# EAGLE design transponder-10.9.0 (EAGLE 9.6.2)
Assembly variants: Production

## Sheet 1 of 7
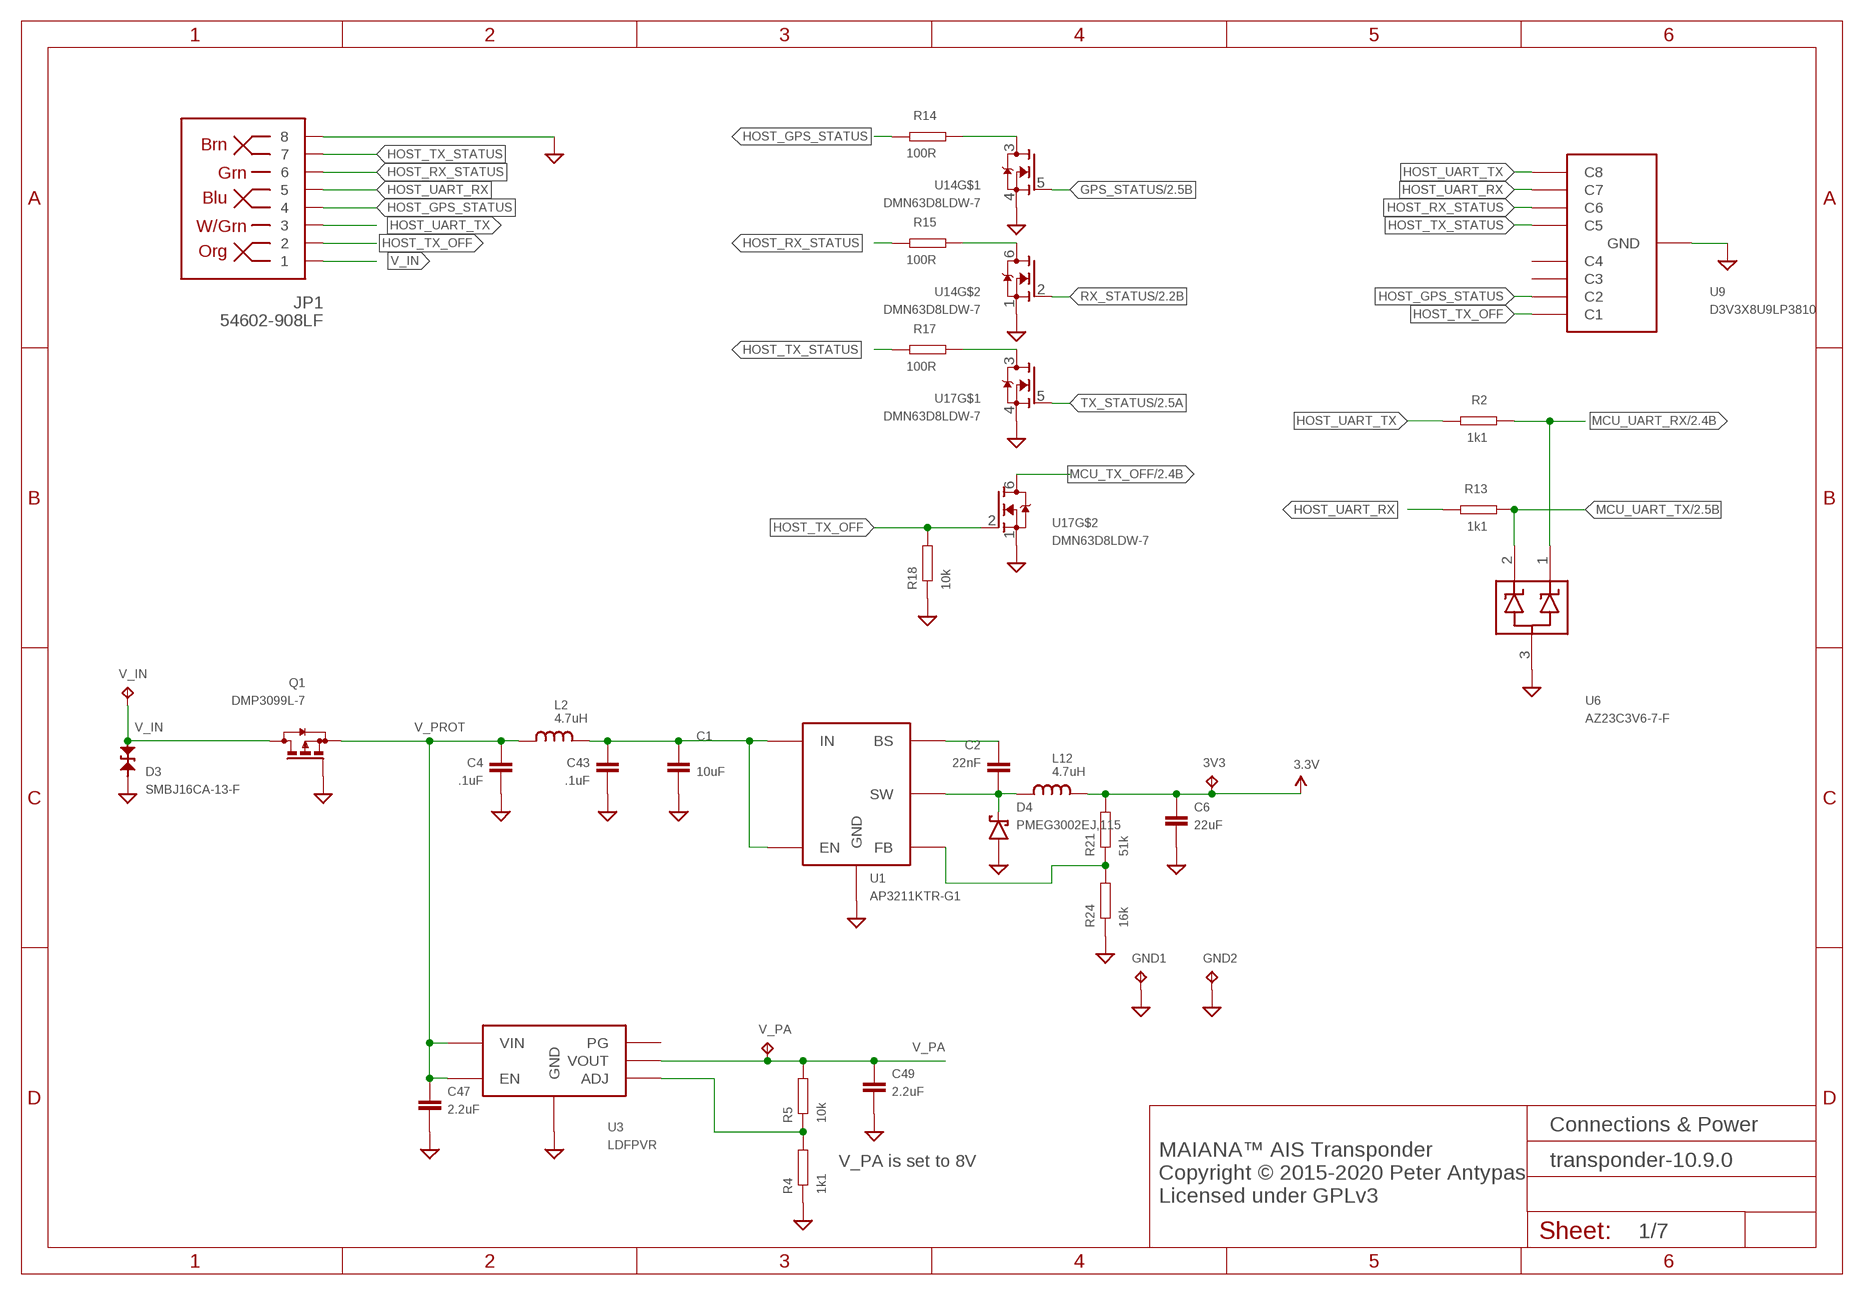
[diagram p0: schematic, sheet 1]

### Parts
3V3  TPTP12R  [TP12R]
C1  10uF  CAPACITOR0805  [0805]
C2  22nF  CAPACITOR0603  [0603]
C4  .1uF  CAPACITOR0603  [0603]
C6  22uF  CAPACITOR0805  [0805]
C43  .1uF  CAPACITOR0603  [0603]
C47  2.2uF  CAPACITOR0603  [0603]
C49  2.2uF  CAPACITOR0603  [0603]
D3  SMBJ16CA-13-F  DIODE-TVS-BIDIRSMB  [SMB-BIDIR]
D4  PMEG3002EJ,115  DIODE-SCHOTTKYSOD323  [SOD323]
GND1  TPTP12R  [TP12R]
GND2  TPTP12R  [TP12R]
JP1  54602-908LF  RJ45-8PTH  [RJ45-8]
L2  4.7uH  INDUCTOR0805  [0805]
L12  4.7uH  INDUCTOR0805  [0805]
Q1  DMP3099L-7  BSS84  [SOT23]
R2  1k1  RESISTOR0603  [0603]
R4  1k1  RESISTOR0603  [0603]
R5  10k  RESISTOR0603  [0603]
R13  1k1  RESISTOR0603  [0603]
R14  100R  RESISTOR0603  [0603]
R15  100R  RESISTOR0603  [0603]
R17  100R  RESISTOR0603  [0603]
R18  10k  RESISTOR0603  [0603]
R21  51k  RESISTOR0603  [0603]
R24  16k  RESISTOR0603  [0603]
U1  AP3211KTR-G1  AP3211  [SOT23-6]
U3  LDFPVR  [DFN6-2X2]
U6  AZ23C3V6-7-F  [SOT-23]
U9  D3V3X8U9LP3810  [U-DFN3810-9(B)]
U14  DMN63D8LDW-7  DMN63D8LDW  [SOT363]
U17  DMN63D8LDW-7  DMN63D8LDW  [SOT363]
V_IN  TPTP12R  [TP12R]
V_PA  TPTP12R  [TP12R]

### Nets
3.3V: 3V3.TP C6.P$1 L12.P$2 R21.P$2 ; also sheet 2,4,6,7
GND: C1.P$2 C4.P$2 C6.P$2 C43.P$2 C47.P$2 C49.P$2 D3.C D4.A GND1.TP GND2.TP JP1.8 Q1.1(G) R4.P$1 R18.P$1 R24.P$1 U1.2(GND) U3.P$4(GND) U3.P$7(GND) U6.3 U9.P$3(GND) U14.1(S) U14.4(S) U17.1(S) U17.4(S) ; also sheet 2,3,4,5,6,7
GPS_STATUS: U14.5(G) ; also sheet 2
HOST_GPS_STATUS: JP1.4 R14.P$2 U9.P$2(C2)
HOST_RX_STATUS: JP1.6 R15.P$2 U9.P$7(C6)
HOST_TX_OFF: JP1.2 R18.P$2 U9.P$1(C1) U17.2(G)
HOST_TX_STATUS: JP1.7 R17.P$2 U9.P$6(C5)
HOST_UART_RX: JP1.5 R13.P$2 U9.P$8(C7)
HOST_UART_TX: JP1.3 R2.P$2 U9.P$9(C8)
MCU_TX_OFF: U17.6(D) ; also sheet 2
MCU_UART_RX: R2.P$1 U6.1 ; also sheet 2
MCU_UART_TX: R13.P$1 U6.2 ; also sheet 2
N$8: C2.P$2 D4.C L12.P$1 U1.6(SW)
N$13: R14.P$1 U14.3(D)
N$14: R15.P$1 U14.6(D)
N$20: R17.P$1 U17.3(D)
N$21: C2.P$1 U1.1(BS)
N$22: R21.P$1 R24.P$2 U1.3(FB)
N$27: C1.P$1 C43.P$1 L2.P$2 U1.4(EN) U1.5(IN)
N$32: R4.P$2 R5.P$1 U3.P$2(ADJ)
RX_STATUS: U14.2(G) ; also sheet 2
TX_STATUS: U17.5(G) ; also sheet 2
V_IN: D3.A JP1.1 Q1.3(D) V_IN.TP
V_PA: C49.P$1 R5.P$2 U3.P$1(VOUT) V_PA.TP ; also sheet 5
V_PROT: C4.P$1 C47.P$1 L2.P$1 Q1.2(S) U3.P$5(EN) U3.P$6(VIN)
Unconnected: U3.P$3(PG) U9.P$4(C3) U9.P$5(C4)

### Notes on the sheet
- Connections & Power
- V_PA is set to 8V
- MAIANA™ AIS Transponder
  Copyright © 2015-2020 Peter Antypas
  Licensed under GPLv3

## Sheet 2 of 7
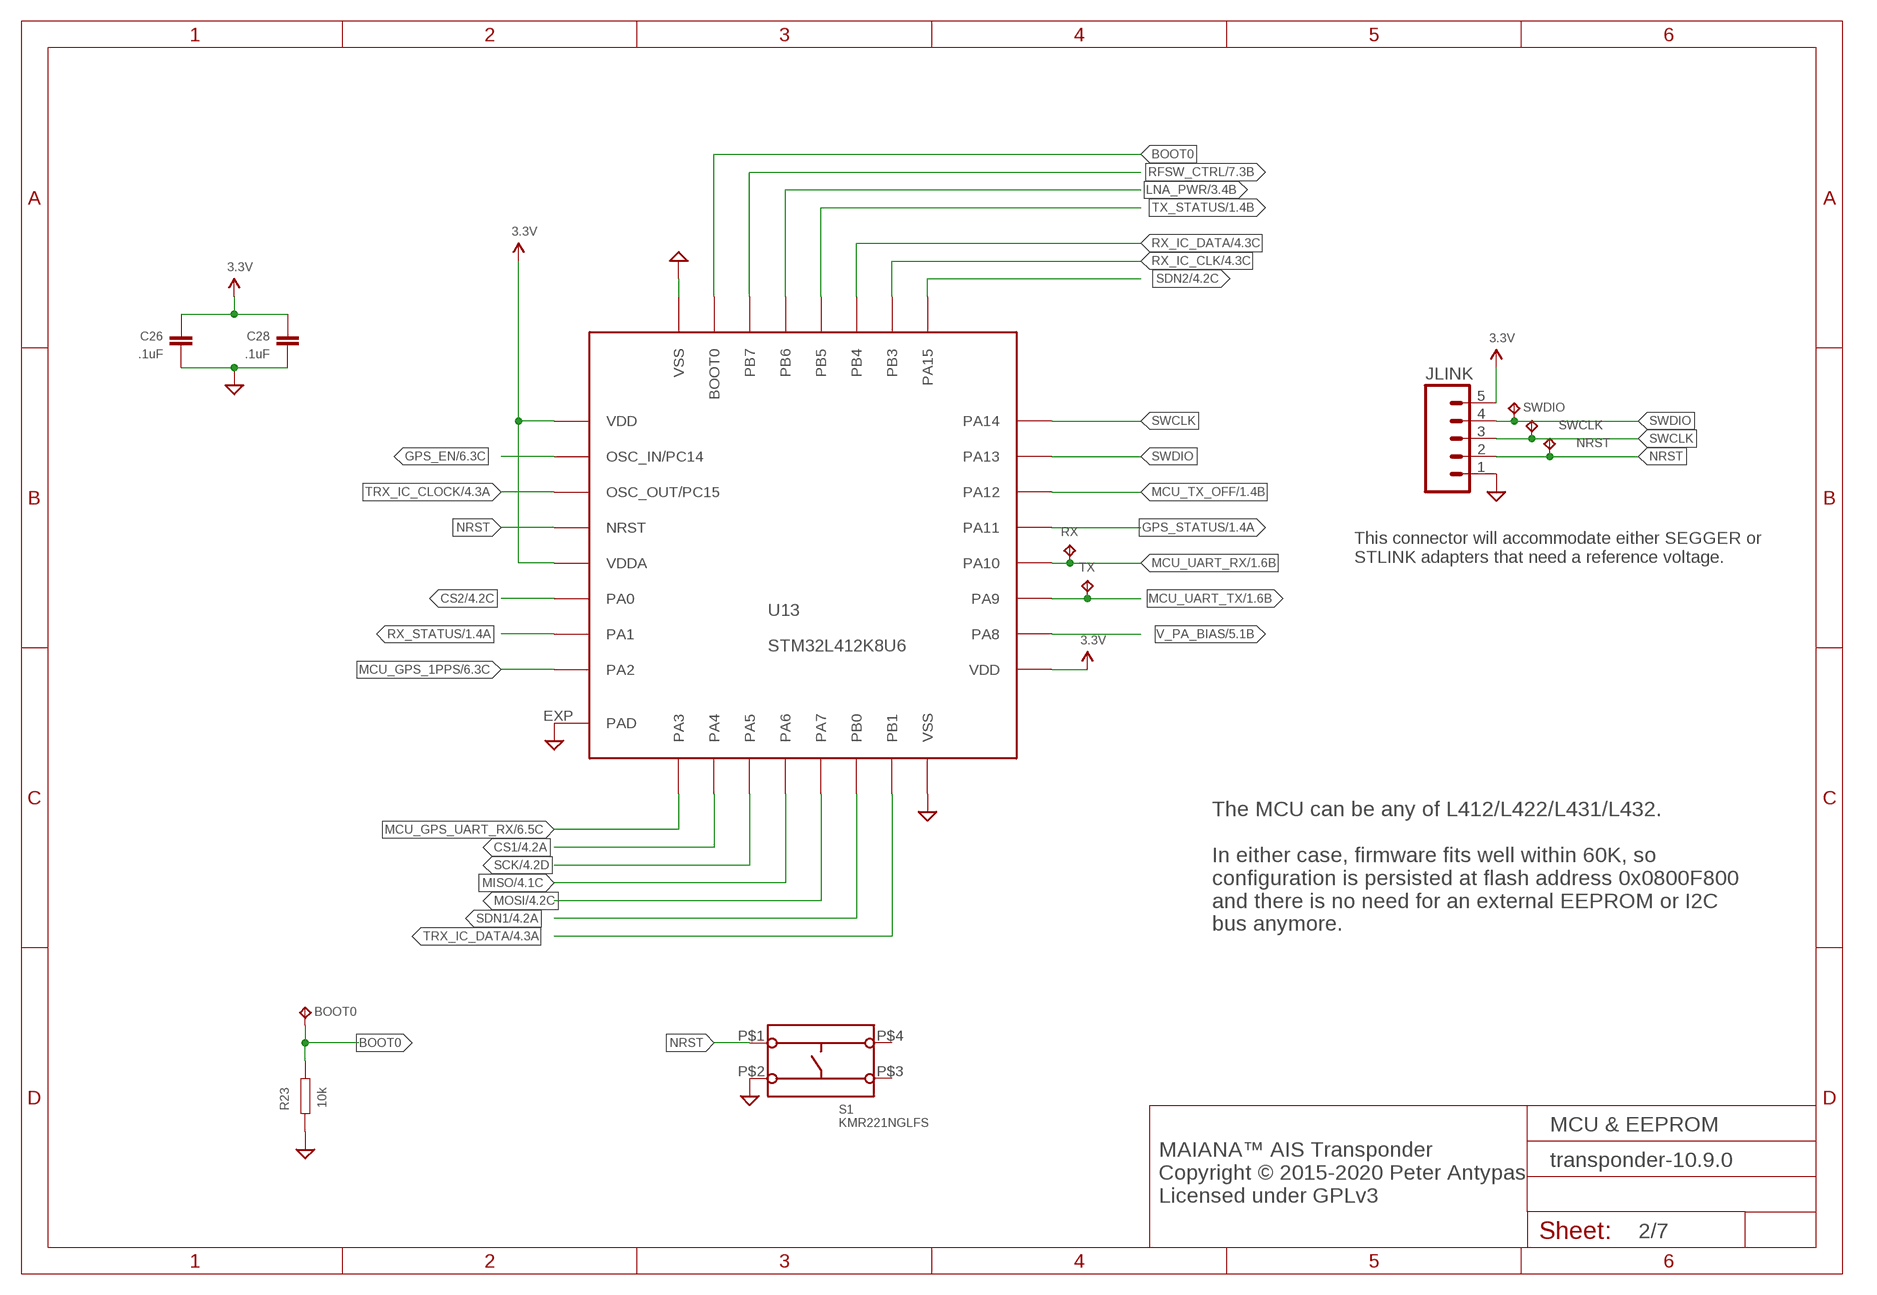
[diagram p1: schematic, sheet 2]

### Parts
BOOT0  TPTP12R  [TP12R]
C26  .1uF  CAPACITOR0603  [0603]
C28  .1uF  CAPACITOR0603  [0603]
JLINK  M05PTH  [1X05]  (not fitted in variant Production)
NRST  TPTP12R  [TP12R]
R23  10k  RESISTOR0603  [0603]
RX  TPTP12R  [TP12R]
S1  KMR221NGLFS  [KMR221NGLFS]  (not fitted in variant Production)
SWCLK  TPTP12R  [TP12R]
SWDIO  TPTP12R  [TP12R]
TX  TPTP12R  [TP12R]
U13  STM32L412K8U6  STM32L432KXXX  [QFN32]

### Nets
3.3V: C26.P$1 C28.P$1 JLINK.5 U13.1(VDD) U13.5(VDDA) U13.17(VDD) ; also sheet 1,4,6,7
BOOT0: BOOT0.TP R23.P$1 U13.31(BOOT0)
CS1: U13.10(PA4) ; also sheet 4
CS2: U13.6(PA0) ; also sheet 4
GND: C26.P$2 C28.P$2 JLINK.1 R23.P$2 S1.P$2(S2) U13.16(VSS) U13.32(VSS) U13.EXP(PAD) ; also sheet 1,3,4,5,6,7
GPS_EN: U13.2(OSC_IN/PC14) ; also sheet 6
GPS_STATUS: U13.21(PA11) ; also sheet 1
LNA_PWR: U13.29(PB6) ; also sheet 3
MCU_GPS_1PPS: U13.8(PA2) ; also sheet 6
MCU_GPS_UART_RX: U13.9(PA3) ; also sheet 6
MCU_TX_OFF: U13.22(PA12) ; also sheet 1
MCU_UART_RX: RX.TP U13.20(PA10) ; also sheet 1
MCU_UART_TX: TX.TP U13.19(PA9) ; also sheet 1
MISO: U13.12(PA6) ; also sheet 4
MOSI: U13.13(PA7) ; also sheet 4
NRST: JLINK.2 NRST.TP S1.P$1(S1) U13.4(NRST)
RFSW_CTRL: U13.30(PB7) ; also sheet 7
RX_IC_CLK: U13.26(PB3) ; also sheet 4
RX_IC_DATA: U13.27(PB4) ; also sheet 4
RX_STATUS: U13.7(PA1) ; also sheet 1
SCK: U13.11(PA5) ; also sheet 4
SDN1: U13.14(PB0) ; also sheet 4
SDN2: U13.25(PA15) ; also sheet 4
SWCLK: JLINK.3 SWCLK.TP U13.24(PA14)
SWDIO: JLINK.4 SWDIO.TP U13.23(PA13)
TRX_IC_CLOCK: U13.3(OSC_OUT/PC15) ; also sheet 4
TRX_IC_DATA: U13.15(PB1) ; also sheet 4
TX_STATUS: U13.28(PB5) ; also sheet 1
V_PA_BIAS: U13.18(PA8) ; also sheet 5
Unconnected: S1.P$3(S2) S1.P$4(S1)

### Notes on the sheet
- This connector will accommodate either SEGGER or
  STLINK adapters that need a reference voltage.
- The MCU can be any of L412/L422/L431/L432.
  
  In either case, firmware fits well within 60K, so 
  configuration is persisted at flash address 0x0800F800
  and there is no need for an external EEPROM or I2C
  bus anymore.
- MCU & EEPROM
- MAIANA™ AIS Transponder
  Copyright © 2015-2020 Peter Antypas
  Licensed under GPLv3

## Sheet 3 of 7
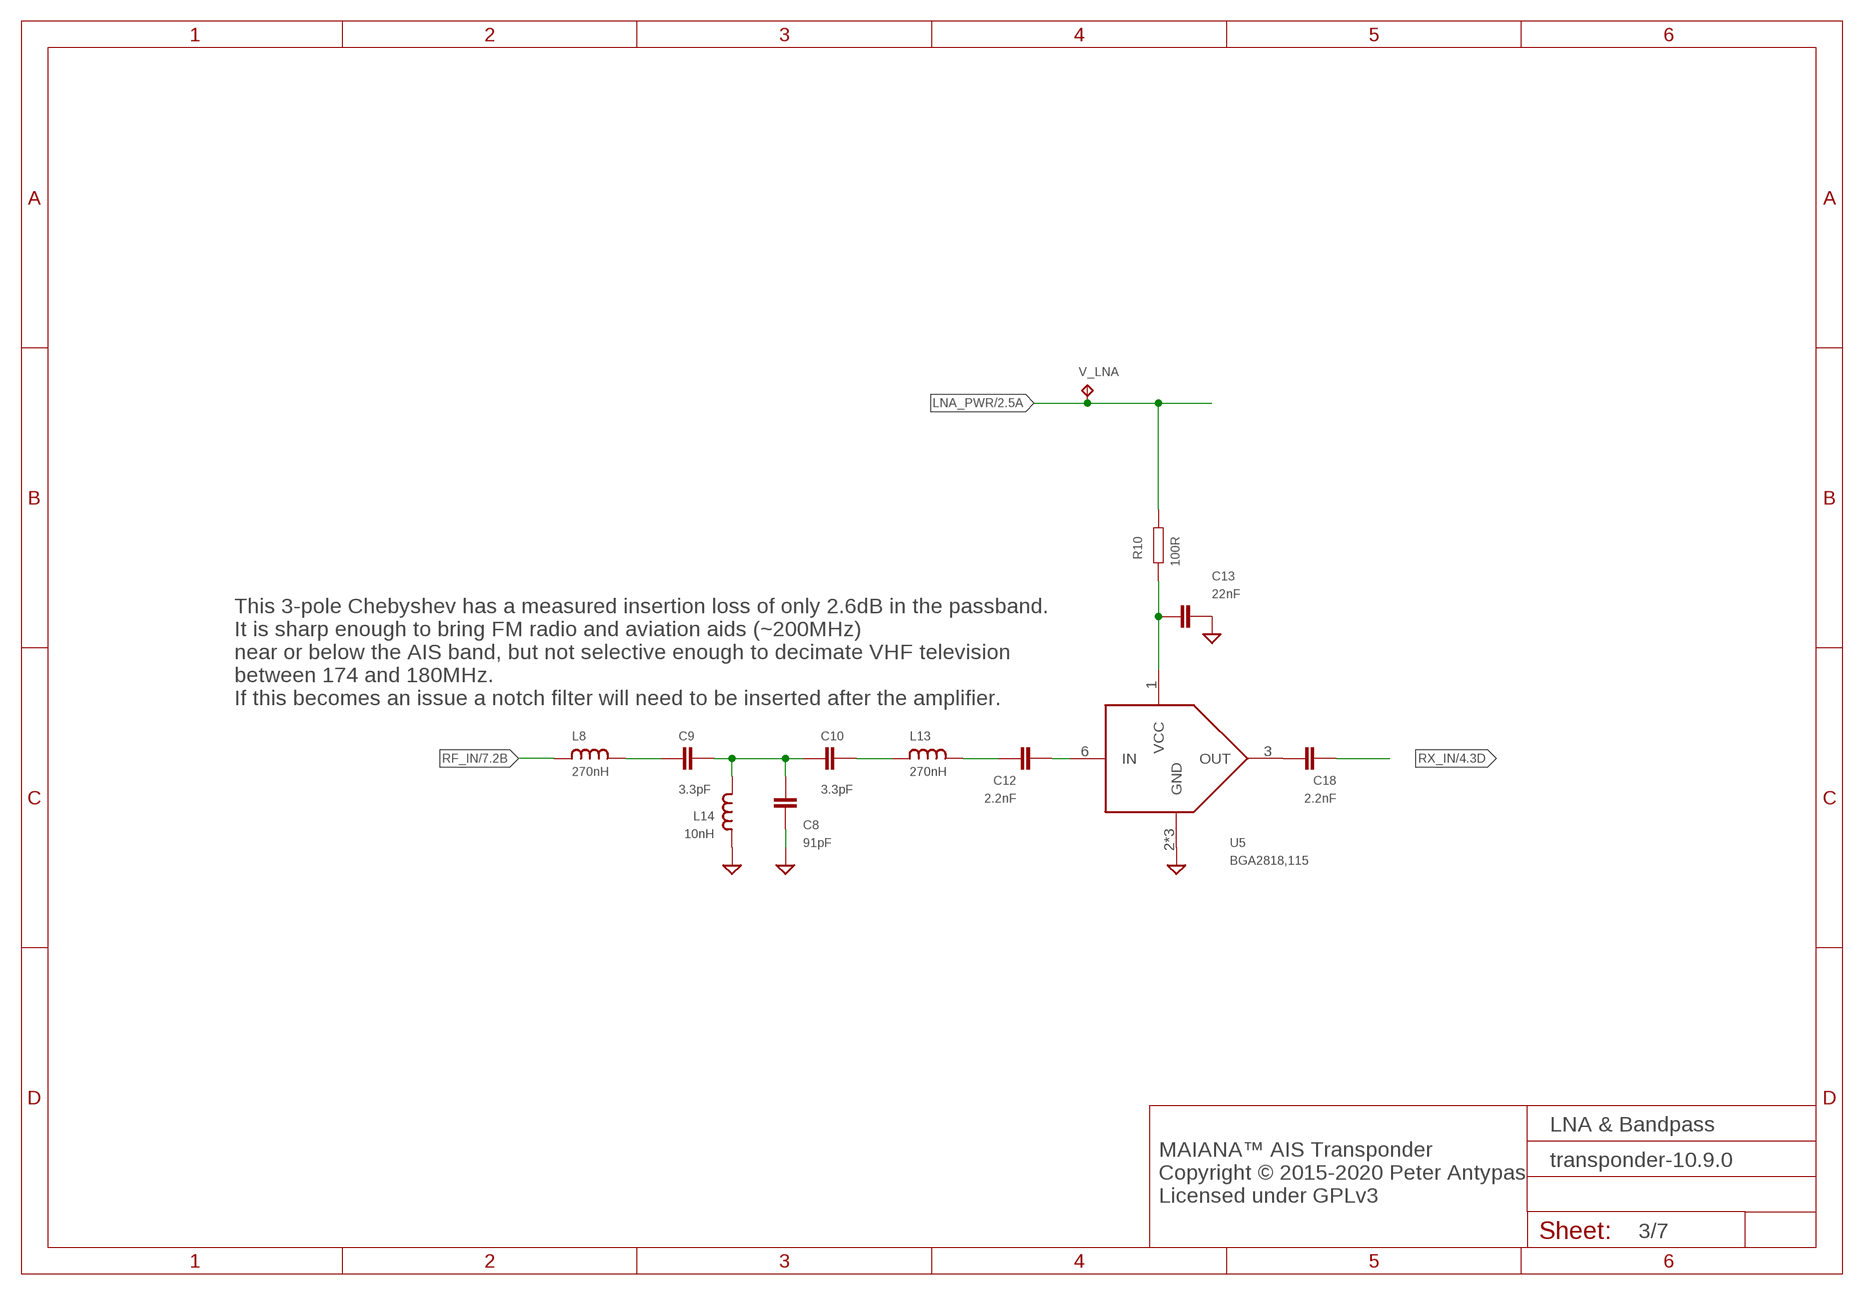
[diagram p2: schematic, sheet 3]

### Parts
C8  91pF  CAPACITOR0603  [0603]
C9  3.3pF  CAPACITOR0603  [0603]
C10  3.3pF  CAPACITOR0603  [0603]
C12  2.2nF  CAPACITOR0603  [0603]
C13  22nF  CAPACITOR0603  [0603]
C18  2.2nF  CAPACITOR0603  [0603]
L8  270nH  INDUCTOR0603  [0603]
L13  270nH  INDUCTOR0603  [0603]
L14  10nH  INDUCTOR0603  [0603]
R10  100R  RESISTOR0603  [0603]
U5  BGA2818,115  BGA2870  [SOT363]
V_LNA  TPTP12R  [TP12R]

### Nets
GND: C8.P$2 C13.P$2 L14.P$1 U5.2(GND) U5.4(GND) U5.5(GND) ; also sheet 1,2,4,5,6,7
LNA_PWR: R10.P$1 V_LNA.TP ; also sheet 2
N$1: C12.P$2 U5.6(IN)
N$2: C9.P$1 L8.P$2
N$3: C8.P$1 C9.P$2 C10.P$1 L14.P$2
N$4: C10.P$2 L13.P$1
N$5: C12.P$1 L13.P$2
N$6: C13.P$1 R10.P$2 U5.1(VCC)
N$9: C18.P$1 U5.3(OUT)
RF_IN: L8.P$1 ; also sheet 7
RX_IN: C18.P$2 ; also sheet 4

### Notes on the sheet
- This 3-pole Chebyshev has a measured insertion loss of only 2.6dB in the passband.
  It is sharp enough to bring FM radio and aviation aids (~200MHz)
  near or below the AIS band, but not selective enough to decimate VHF television
  between 174 and 180MHz. 
  If this becomes an issue a notch filter will need to be inserted after the amplifier.
- LNA & Bandpass
- MAIANA™ AIS Transponder
  Copyright © 2015-2020 Peter Antypas
  Licensed under GPLv3

## Sheet 4 of 7
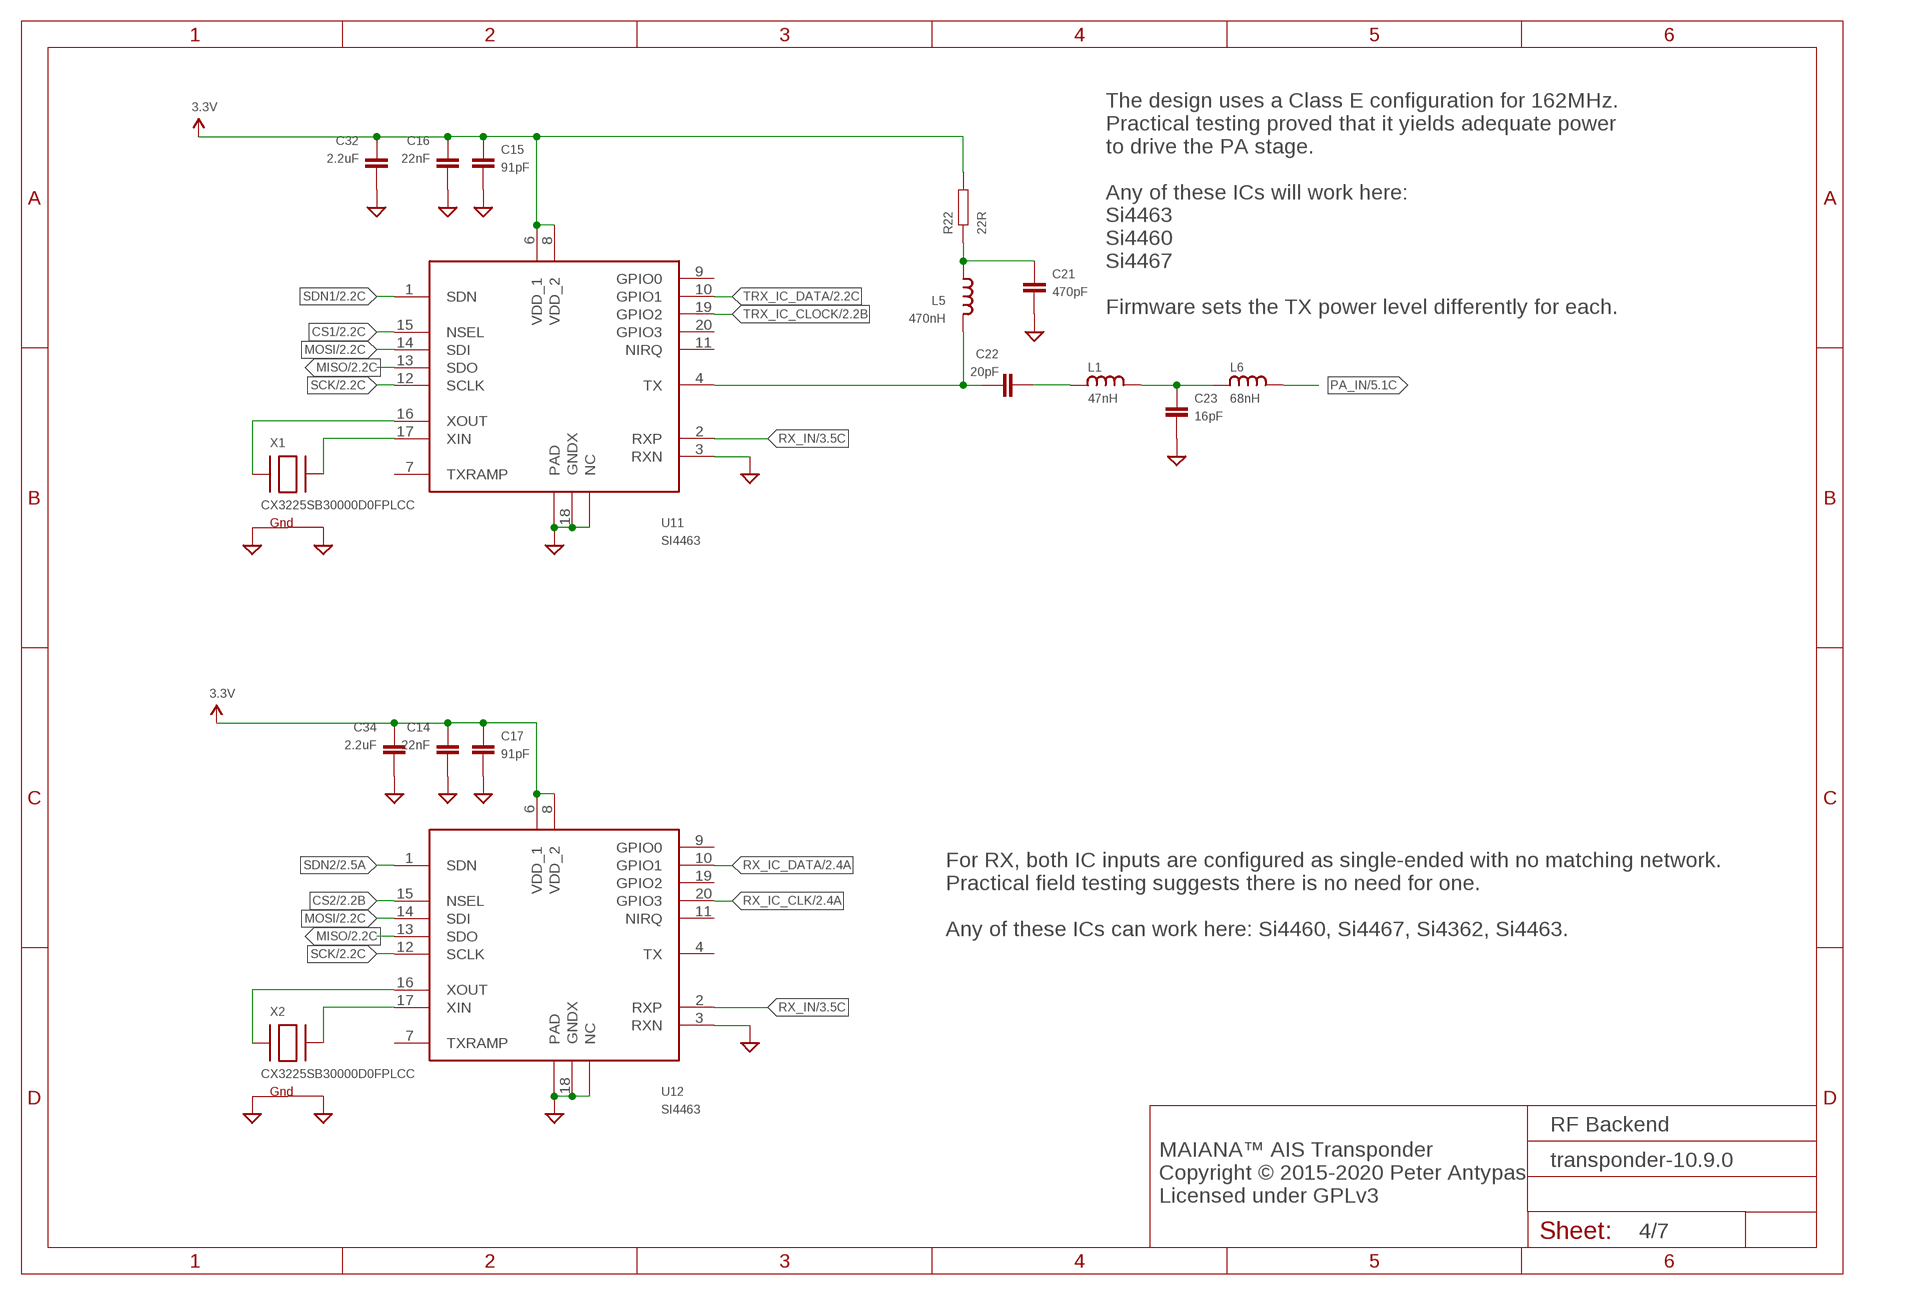
[diagram p3: schematic, sheet 4]

### Parts
C14  22nF  CAPACITOR0603  [0603]
C15  91pF  CAPACITOR0603  [0603]
C16  22nF  CAPACITOR0603  [0603]
C17  91pF  CAPACITOR0603  [0603]
C21  470pF  CAPACITOR0603  [0603]
C22  20pF  CAPACITOR0603  [0603]
C23  16pF  CAPACITOR0603  [0603]
C32  2.2uF  CAPACITOR0603  [0603]
C34  2.2uF  CAPACITOR0603  [0603]
L1  47nH  INDUCTOR0603  [0603]
L5  470nH  INDUCTOR0603  [0603]
L6  68nH  INDUCTOR0603  [0603]
R22  22R  RESISTOR0603  [0603]
U11  SI4463  [SI4463]
U12  SI4463  [SI4463]
X1  CX3225SB30000D0FPLCC  XTAL-4-3225  [NX3225]
X2  CX3225SB30000D0FPLCC  XTAL-4-3225  [NX3225]

### Nets
3.3V: C14.P$1 C15.P$1 C16.P$1 C17.P$1 C32.P$1 C34.P$1 R22.P$2 U11.6(VDD_1) U11.8(VDD_2) U12.6(VDD_1) U12.8(VDD_2) ; also sheet 1,2,6,7
CS1: U11.15(NSEL) ; also sheet 2
CS2: U12.15(NSEL) ; also sheet 2
GND: C14.P$2 C15.P$2 C16.P$2 C17.P$2 C21.P$2 C23.P$2 C32.P$2 C34.P$2 U11.3(RXN) U11.5(NC) U11.18(GNDX) U11.EXP(PAD) U12.3(RXN) U12.5(NC) U12.18(GNDX) U12.EXP(PAD) X1.2(G2) X1.4(G1) X2.2(G2) X2.4(G1) ; also sheet 1,2,3,5,6,7
MISO: U11.13(SDO) U12.13(SDO) ; also sheet 2
MOSI: U11.14(SDI) U12.14(SDI) ; also sheet 2
N$12: C23.P$1 L1.P$2 L6.P$1
N$16: U12.16(XOUT) X2.1(X1)
N$17: U12.17(XIN) X2.3(X2)
N$18: U11.16(XOUT) X1.1(X1)
N$19: U11.17(XIN) X1.3(X2)
N$24: C22.P$1 L5.P$2 U11.4(TX)
N$30: C21.P$1 L5.P$1 R22.P$1
N$31: C22.P$2 L1.P$1
PA_IN: L6.P$2 ; also sheet 5
RX_IC_CLK: U12.20(GPIO3) ; also sheet 2
RX_IC_DATA: U12.10(GPIO1) ; also sheet 2
RX_IN: U11.2(RXP) U12.2(RXP) ; also sheet 3
SCK: U11.12(SCLK) U12.12(SCLK) ; also sheet 2
SDN1: U11.1(SDN) ; also sheet 2
SDN2: U12.1(SDN) ; also sheet 2
TRX_IC_CLOCK: U11.19(GPIO2) ; also sheet 2
TRX_IC_DATA: U11.10(GPIO1) ; also sheet 2
Unconnected: U11.7(TXRAMP) U11.9(GPIO0) U11.11(NIRQ) U11.20(GPIO3) U12.4(TX) U12.7(TXRAMP) U12.9(GPIO0) U12.11(NIRQ) U12.19(GPIO2)

### Notes on the sheet
- The design uses a Class E configuration for 162MHz. 
  Practical testing proved that it yields adequate power 
  to drive the PA stage. 
  
  Any of these ICs will work here:
  Si4463
  Si4460
  Si4467
  
  Firmware sets the TX power level differently for each.
- For RX, both IC inputs are configured as single-ended with no matching network. 
  Practical field testing suggests there is no need for one.
  
  Any of these ICs can work here: Si4460, Si4467, Si4362, Si4463.
- RF Backend
- MAIANA™ AIS Transponder
  Copyright © 2015-2020 Peter Antypas
  Licensed under GPLv3

## Sheet 5 of 7
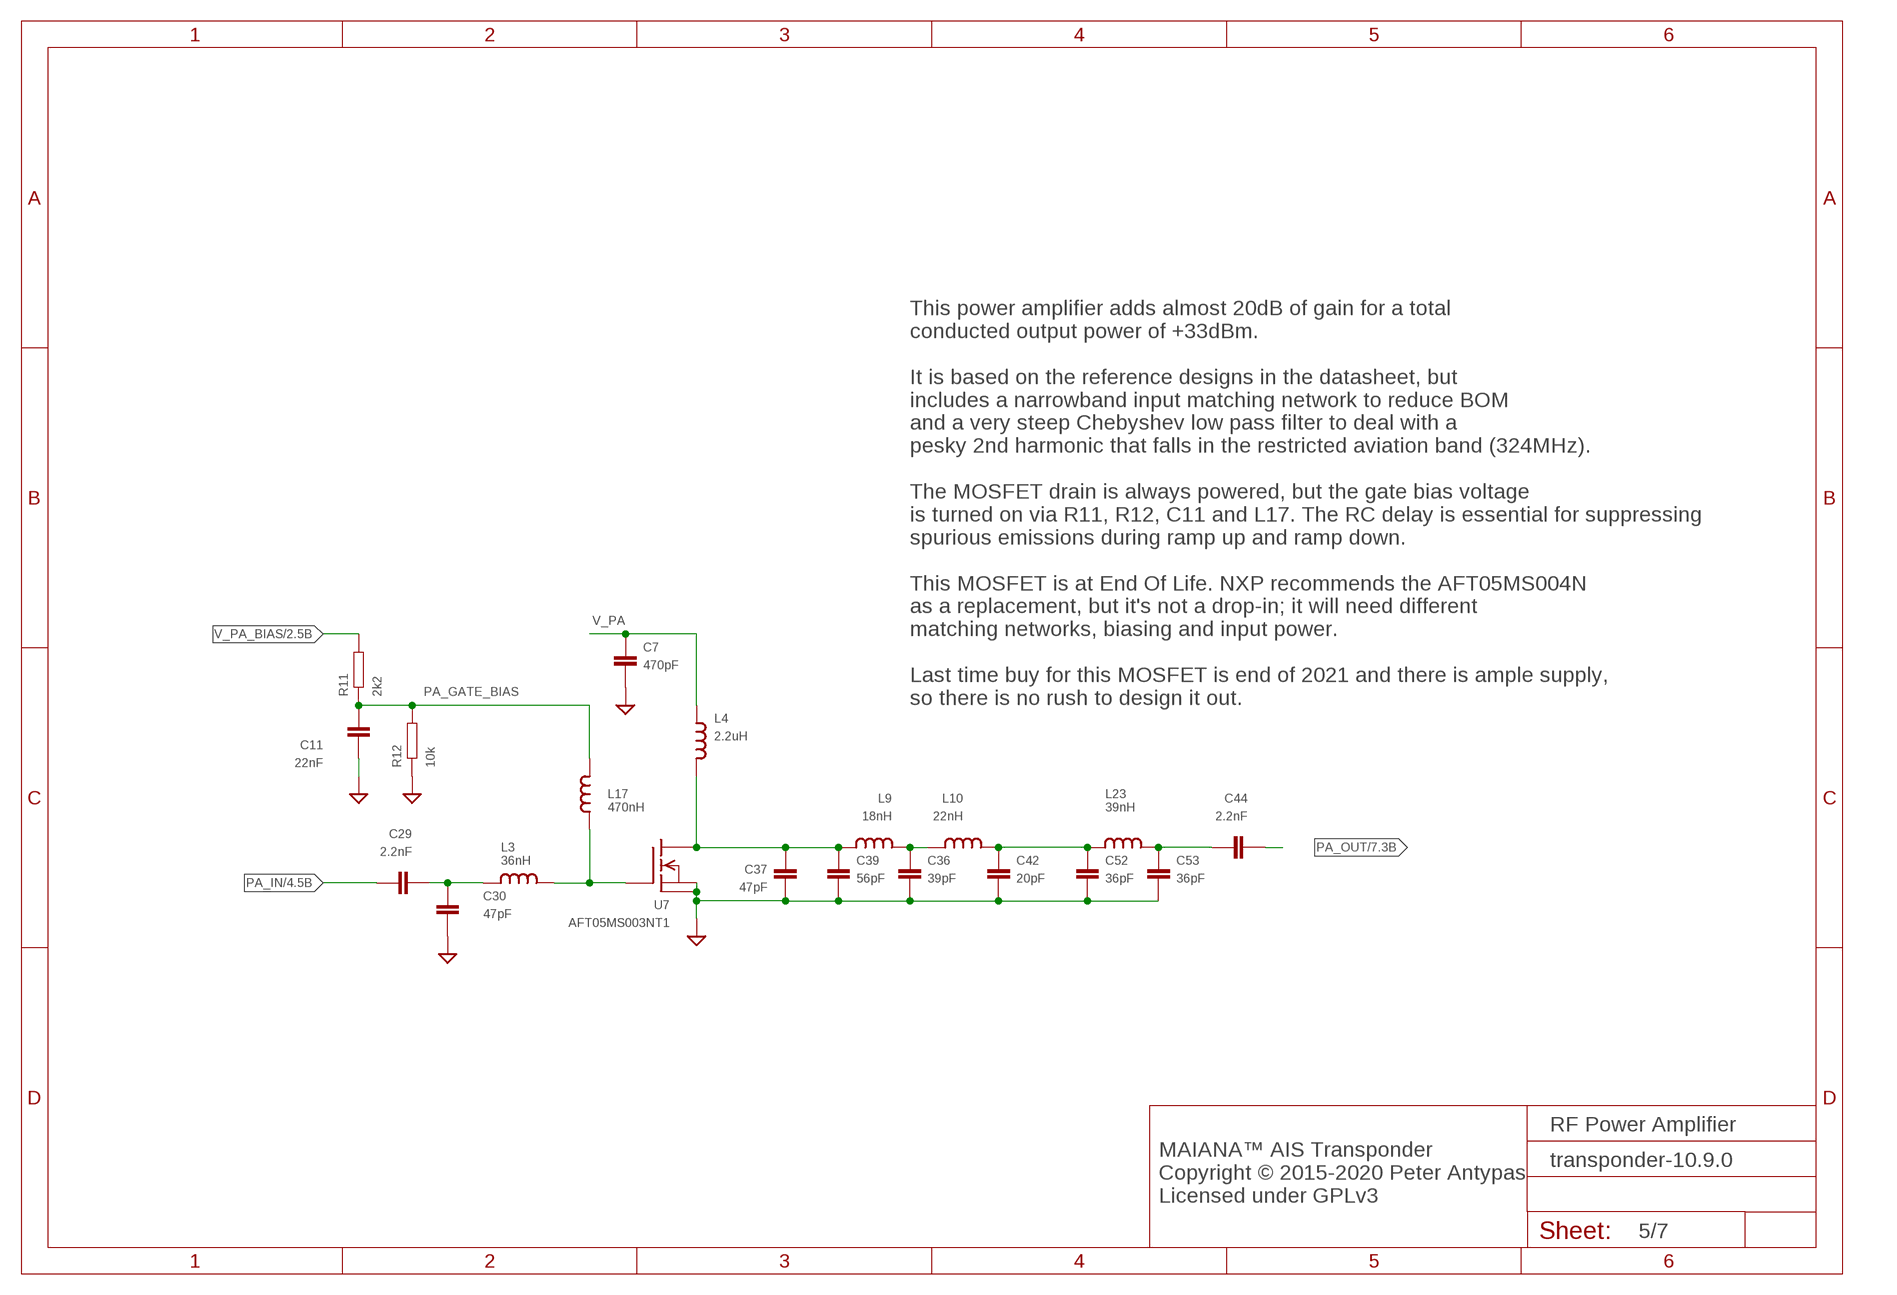
[diagram p4: schematic, sheet 5]

### Parts
C7  470pF  CAPACITOR0603  [0603]
C11  22nF  CAPACITOR0603  [0603]
C29  2.2nF  CAPACITOR0603  [0603]
C30  47pF  CAPACITOR0603  [0603]
C36  39pF  CAPACITOR0603  [0603]
C37  47pF  CAPACITOR0603  [0603]
C39  56pF  CAPACITOR0603  [0603]
C42  20pF  CAPACITOR0603  [0603]
C44  2.2nF  CAPACITOR0603  [0603]
C52  36pF  CAPACITOR0603  [0603]
C53  36pF  CAPACITOR0603  [0603]
L3  36nH  INDUCTOR0603  [0603]
L4  2.2uH  INDUCTOR0805  [0805]
L9  18nH  INDUCTOR0603  [0603]
L10  22nH  INDUCTOR0603  [0603]
L17  470nH  INDUCTOR0603  [0603]
L23  39nH  INDUCTOR0603  [0603]
R11  2k2  RESISTOR0603  [0603]
R12  10k  RESISTOR0603  [0603]
U7  AFT05MS003NT1  AFT0SMS003N  [SOT-89]

### Nets
GND: C7.P$2 C11.P$2 C30.P$2 C36.P$2 C37.P$2 C39.P$2 C42.P$2 C52.P$2 C53.P$2 R12.P$1 U7.2(S) U7.2@1(PAD) ; also sheet 1,2,3,4,6,7
N$23: C37.P$1 C39.P$1 L4.P$2 L9.P$1 U7.3(D)
N$26: L3.P$2 L17.P$1 U7.1(G)
N$28: C36.P$1 L9.P$2 L10.P$1
N$29: C29.P$2 C30.P$1 L3.P$1
N$40: C42.P$1 C52.P$1 L10.P$2 L23.P$1
N$41: C44.P$1 C53.P$1 L23.P$2
PA_GATE_BIAS: C11.P$1 L17.P$2 R11.P$1 R12.P$2
PA_IN: C29.P$1 ; also sheet 4
PA_OUT: C44.P$2 ; also sheet 7
V_PA: C7.P$1 L4.P$1 ; also sheet 1
V_PA_BIAS: R11.P$2 ; also sheet 2

### Notes on the sheet
- This power amplifier adds almost 20dB of gain for a total
  conducted output power of +33dBm. 
  
  It is based on the reference designs in the datasheet, but
  includes a narrowband input matching network to reduce BOM
  and a very steep Chebyshev low pass filter to deal with a
  pesky 2nd harmonic that falls in the restricted aviation band (324MHz).
  
  The MOSFET drain is always powered, but the gate bias voltage
  is turned on via R11, R12, C11 and L17. The RC delay is essential for suppressing
  spurious emissions during ramp up and ramp down.
  
  This MOSFET is at End Of Life. NXP recommends the AFT05MS004N 
  as a replacement, but it's not a drop-in; it will need different
  matching networks, biasing and input power.
  
  Last time buy for this MOSFET is end of 2021 and there is ample supply,
  so there is no rush to design it out.
- RF Power Amplifier
- MAIANA™ AIS Transponder
  Copyright © 2015-2020 Peter Antypas
  Licensed under GPLv3

## Sheet 6 of 7
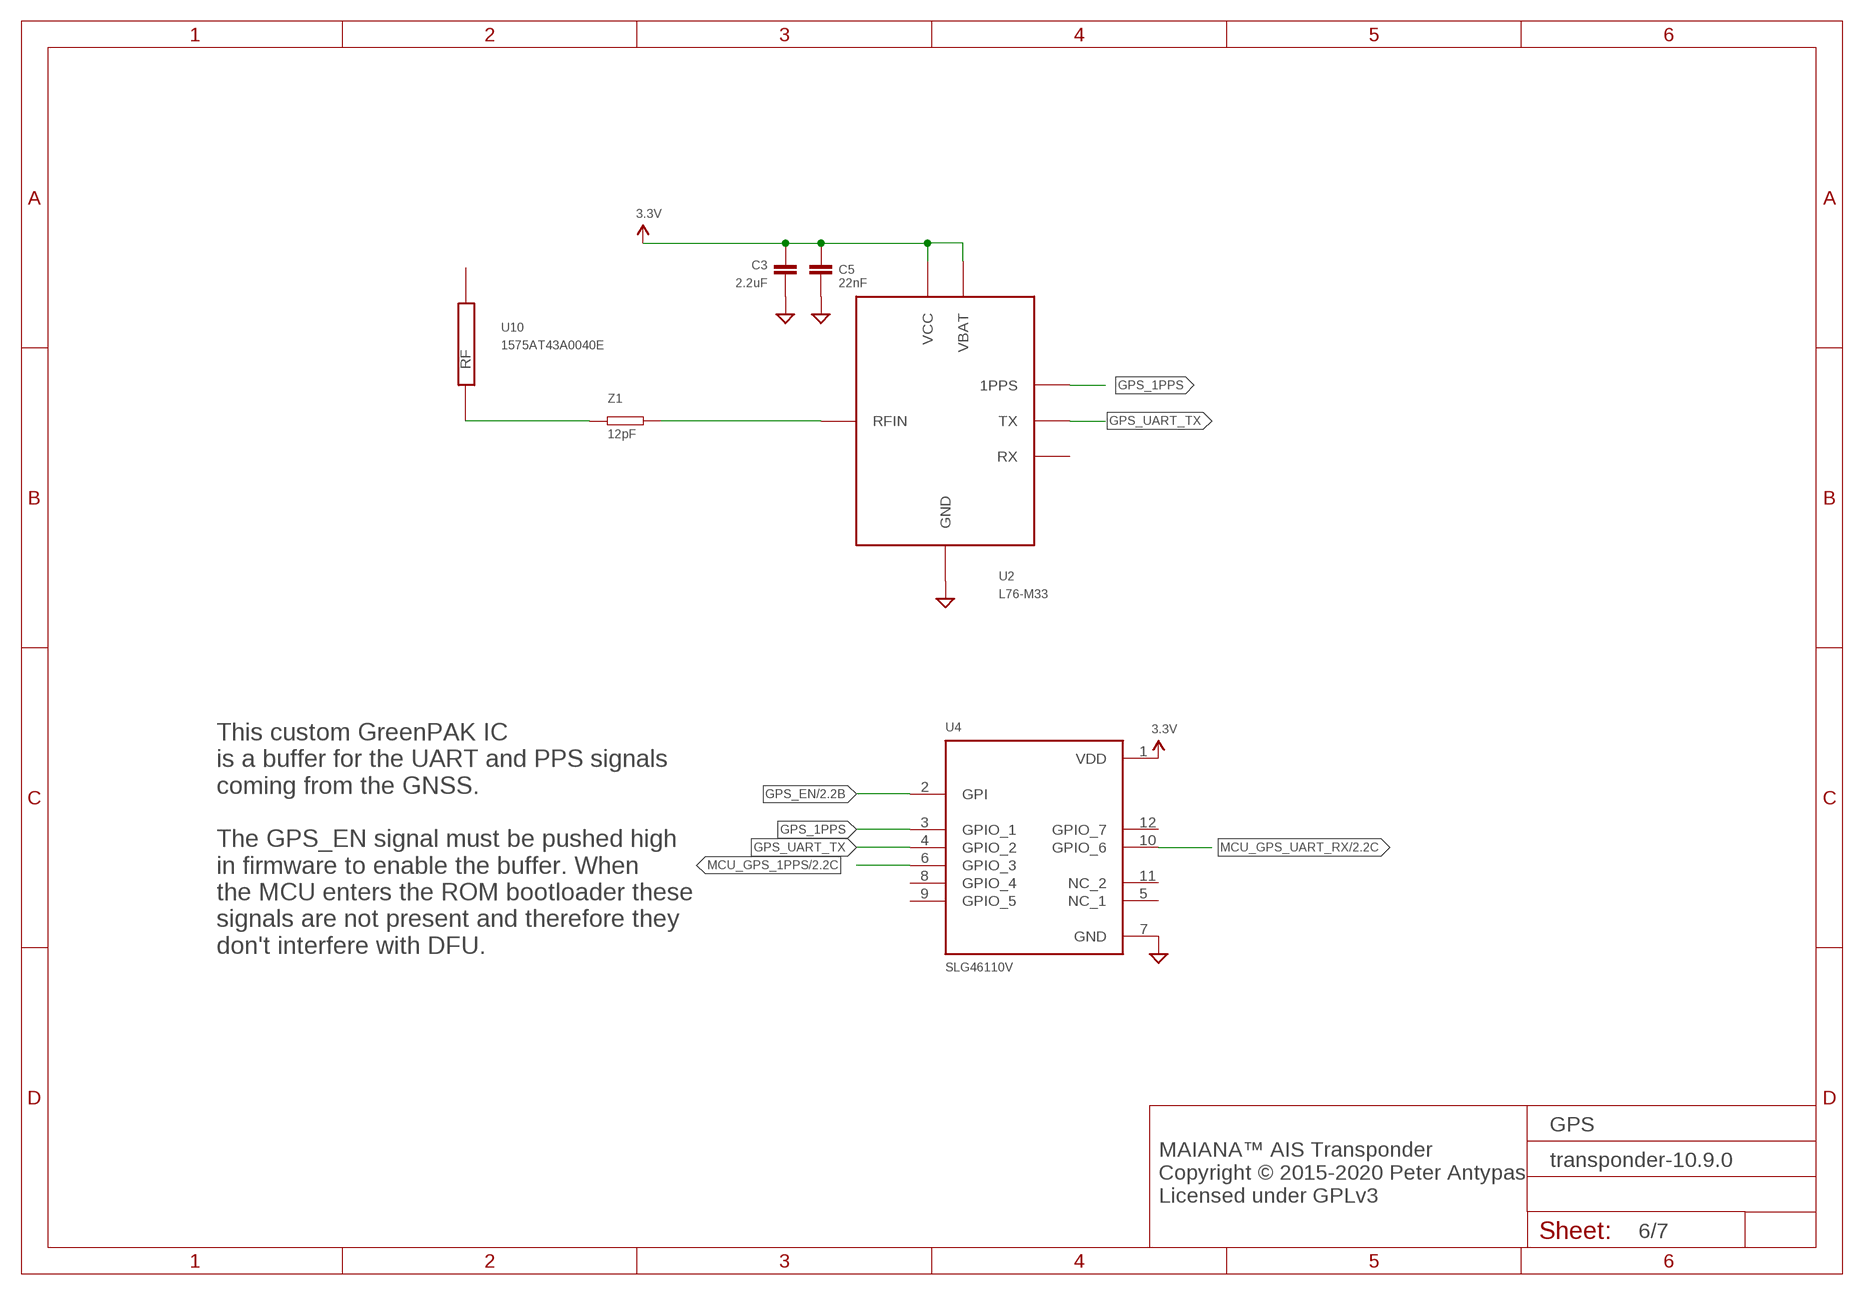
[diagram p5: schematic, sheet 6]

### Parts
C3  2.2uF  CAPACITOR0603  [0603]
C5  22nF  CAPACITOR0603  [0603]
U2  L76-M33  L70  [GPS_MODULE]
U4  SLG46110V  [IC_SLG46110V]
U10  1575AT43A0040E  [1575AT43A0040E]
Z1  12pF  RESISTOR0603  [0603]

### Nets
3.3V: C3.P$1 C5.P$1 U2.P$6(VBAT) U2.P$8(VCC) U4.1(VDD) ; also sheet 1,2,4,7
GND: C3.P$2 C5.P$2 U2.P$1(GND) U2.P$10(GND) U2.P$12(GND) U4.7(GND) ; also sheet 1,2,3,4,5,7
GPS_1PPS: U2.P$4(1PPS) U4.3(GPIO_1)
GPS_EN: U4.2(GPI) ; also sheet 2
GPS_UART_TX: U2.P$2(TX) U4.4(GPIO_2)
MCU_GPS_1PPS: U4.6(GPIO_3) ; also sheet 2
MCU_GPS_UART_RX: U4.10(GPIO_6) ; also sheet 2
N$33: U10.P$1(RF) Z1.P$1
N$34: U2.P$11(RFIN) Z1.P$2
Unconnected: U2.P$3(RX) U4.5(NC_1) U4.8(GPIO_4) U4.9(GPIO_5) U4.11(NC_2) U4.12(GPIO_7) U10.P$2(PAD)

### Notes on the sheet
- This custom GreenPAK IC
  is a buffer for the UART and PPS signals
  coming from the GNSS.
  
  The GPS_EN signal must be pushed high
  in firmware to enable the buffer. When 
  the MCU enters the ROM bootloader these
  signals are not present and therefore they
  don't interfere with DFU.
- GPS
- MAIANA™ AIS Transponder
  Copyright © 2015-2020 Peter Antypas
  Licensed under GPLv3

## Sheet 7 of 7
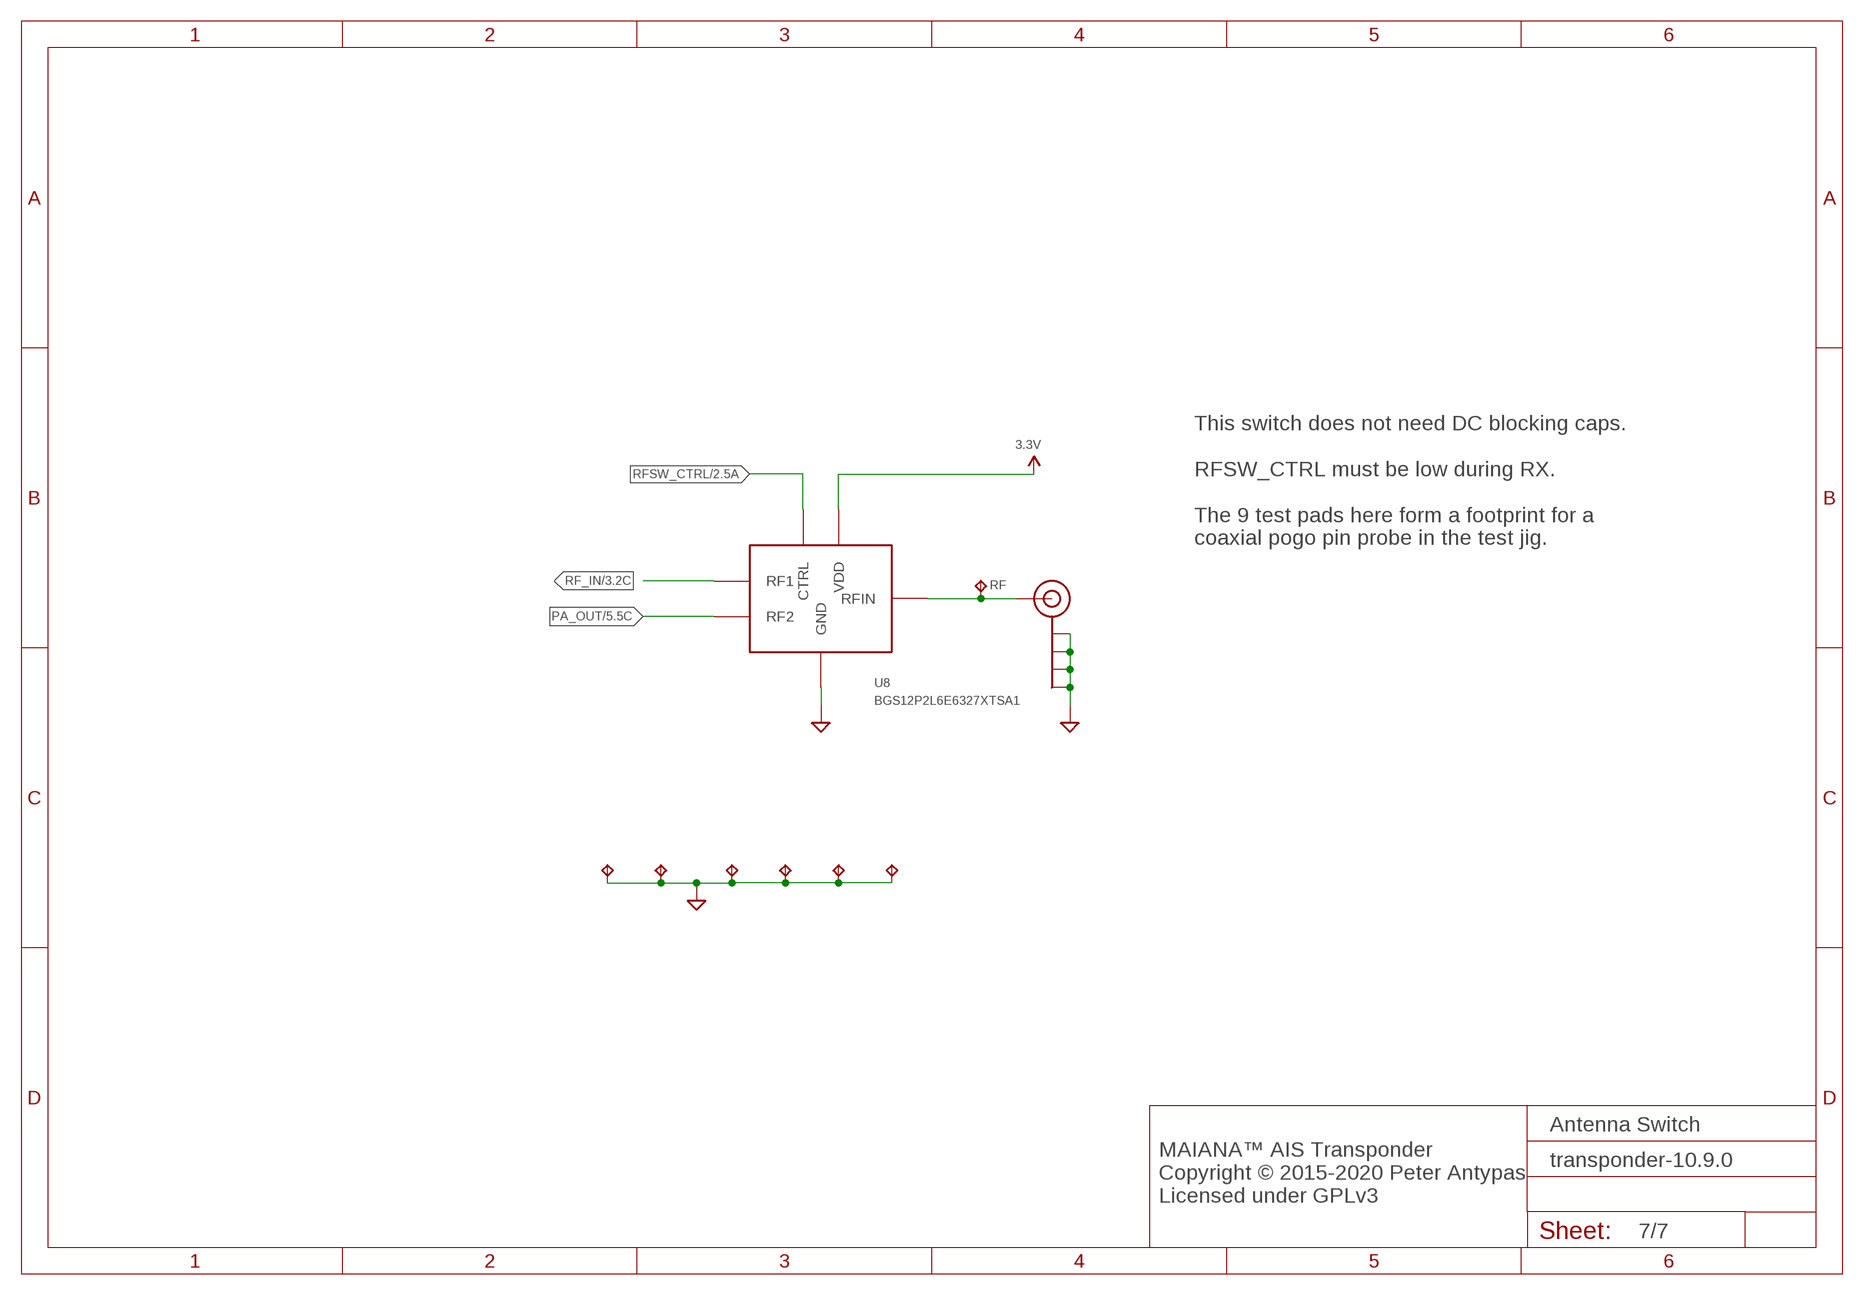
[diagram p6: schematic, sheet 7]

### Parts
J$1  SMA_EDGE  [SMA-EDGE]
RF  TPTP10R  [TP10R]
SWDIO1  TPTP12R  [TP12R]
SWDIO2  TPTP12R  [TP12R]
SWDIO3  TPTP12R  [TP12R]
SWDIO4  TPTP12R  [TP12R]
SWDIO5  TPTP12R  [TP12R]
SWDIO6  TPTP12R  [TP12R]
U8  BGS12P2L6E6327XTSA1  BGS12PL6  [PSON50P145X100X50-6N]

### Nets
3.3V: U8.4(VDD) ; also sheet 1,2,4,6
GND: J$1.GND@0(GND) J$1.GND@1(GND) J$1.GND@2(GND) J$1.GND@3(GND) SWDIO1.TP SWDIO2.TP SWDIO3.TP SWDIO4.TP SWDIO5.TP SWDIO6.TP U8.2(GND) ; also sheet 1,2,3,4,5,6
N$15: J$1.SIG(SIGNAL) RF.TP U8.5(RFIN)
PA_OUT: U8.1(RF2) ; also sheet 5
RF_IN: U8.3(RF1) ; also sheet 3
RFSW_CTRL: U8.6(CTRL) ; also sheet 2

### Notes on the sheet
- This switch does not need DC blocking caps.
  
  RFSW_CTRL must be low during RX.
  
  The 9 test pads here form a footprint for a
  coaxial pogo pin probe in the test jig.
- Antenna Switch
- MAIANA™ AIS Transponder
  Copyright © 2015-2020 Peter Antypas
  Licensed under GPLv3

## Library data of the parts
3V3 BOOT0 GND1 GND2 NRST RF RX SWCLK SWDIO SWDIO1-SWDIO6 TX V_IN V_LNA V_PA = testpad:TP: Test pad; DNP: T
C1 = MyPassives:CAPACITOR: Standard SMD capacitor; PARTNO: EMK212ABJ106KG-T
C2 C5 C11 C13 C14 C16 = MyPassives:CAPACITOR: Standard SMD capacitor; PARTNO: GRM188R71E223KA01D
C3 C32 C34 C47 C49 = MyPassives:CAPACITOR: Standard SMD capacitor; PARTNO: EMK107BJ225KA-T
C4 C26 C28 C43 = MyPassives:CAPACITOR: Standard SMD capacitor; PARTNO: EMK107B7104KAHT
C6 = MyPassives:CAPACITOR: Standard SMD capacitor; PARTNO: *
C7 C21 = MyPassives:CAPACITOR: Standard SMD capacitor; PARTNO: GRM1885C1H471JA01D
C8 C15 C17 = MyPassives:CAPACITOR: Standard SMD capacitor; PARTNO: GRM1885C2A910JA01D
C9 C10 = MyPassives:CAPACITOR: Standard SMD capacitor; PARTNO: GRM1885C1H3R3BA01D
C12 C18 C29 C44 = MyPassives:CAPACITOR: Standard SMD capacitor; PARTNO: GRM1885C1H222JA01J
C22 C42 = MyPassives:CAPACITOR: Standard SMD capacitor; PARTNO: GRM1885C1H200JA01D
C23 = MyPassives:CAPACITOR: Standard SMD capacitor; PARTNO: GCM1885C2A160JA16D
C30 C37 = MyPassives:CAPACITOR: Standard SMD capacitor; PARTNO: GRM1885C1H470JA01J
C36 = MyPassives:CAPACITOR: Standard SMD capacitor; PARTNO: GRM1885C1H390JA01D
C39 = MyPassives:CAPACITOR: Standard SMD capacitor; PARTNO: GRM1885C1H560JA01D
C52 C53 = MyPassives:CAPACITOR: Standard SMD capacitor; PARTNO: 06035A360JAT2A
D3 = MyDiodes:DIODE-TVS-BIDIR: Bidirectional TVS diode; PARTNO: SMBJ16CA-13-F
D4 = MyDiodes:DIODE-SCHOTTKY: Standard SMD Schottky diode; PARTNO: NSR0240HT1G
J$1 = SparkFun-Connectors:SMA_EDGE: SMA Antenna Connector End launch SMA connector. The paste layer has been removed so that the connector can be hand soldered onto the board after reflow.; DNP: T
JLINK = SparkFun-Connectors:M05: Header 5 Standard 5-pin 0.1" header. Use with straight break away headers (SKU : PRT-00116), right angle break away headers (PRT-00553), swiss pins (PRT-00743), machine pins (PRT-00117), and female headers (PRT-00115). Molex polarized connector foot print use with SKU : PRT-08230 with associated crimp pins and housings.; DNP: T
JP1 = SparkFun-Connectors:RJ45-8: RJ45 Jack Simple RJ45, 8-pin connection - connector for common Cat5, Cat5e, and Cat6 Ethernet cables. Footprint not yet proven in production. Connector sku is PRT-00643; Breakout PCB sku is BOB-00716.; PARTNO: 54602-908LF‎; PROD_ID: CONN-08506; VALUE: RJ45
L1 = MyPassives:INDUCTOR: Standard SMD inductor; PARTNO: LQW18AN47NG00D
L2 L12 = MyPassives:INDUCTOR: Standard SMD inductor; PARTNO: MLZ2012M4R7WT000
L3 = MyPassives:INDUCTOR: Standard SMD inductor; PARTNO: LQW18AN36NG00D
L4 = MyPassives:INDUCTOR: Standard SMD inductor; PARTNO: BRC2012T2R2MD
L5 L17 = MyPassives:INDUCTOR: Standard SMD inductor; PARTNO: HK1608R47J-T
L6 = MyPassives:INDUCTOR: Standard SMD inductor
L8 L13 = MyPassives:INDUCTOR: Standard SMD inductor; PARTNO: LQW18ANR27J00D
L9 = MyPassives:INDUCTOR: Standard SMD inductor; PARTNO: LQW18AN18NG00D
L10 = MyPassives:INDUCTOR: Standard SMD inductor; PARTNO: LQW18AN22NJ00D
L14 = MyPassives:INDUCTOR: Standard SMD inductor; PARTNO: LQW18AN10NG00D
L23 = MyPassives:INDUCTOR: Standard SMD inductor; PARTNO: LQW18AN39NG00D
Q1 = transistor-small-signal:BSS84: P-CHANNEL MOS FET; PARTNO: DMP3099L-7
R2 R4 R13 = MyPassives:RESISTOR: Standard SMD resistor; PARTNO: RC0603JR-071K1L
R5 R12 R18 R23 = MyPassives:RESISTOR: Standard SMD resistor; PARTNO: RC0603JR-0710KL
R10 R14 R15 = MyPassives:RESISTOR: Standard SMD resistor; PARTNO: RC0603JR-07100RL
R11 = MyPassives:RESISTOR: Standard SMD resistor; PARTNO: RC0603FR-072K2L
R17 = MyPassives:RESISTOR: Standard SMD resistor; PARTNO: RC0603JR-070RL
R21 = MyPassives:RESISTOR: Standard SMD resistor; PARTNO: RC0603JR-0751KL
R22 = MyPassives:RESISTOR: Standard SMD resistor; PARTNO: RC0603JR-0722RL
R24 = MyPassives:RESISTOR: Standard SMD resistor; PARTNO: RC0603FR-1016KL
S1 = c&k-switch:KMR221NGLFS: Miniature tactile switch, 4-lead SMD; DNP: T; PARTNO: KMR221NGLFS
U1 = diodesinc:AP3211; PARTNO: AP3211KTR-G1
U2 = quectel:L70: GPS Module; PARTNO: L70B-M39
U3 = st-power:LDFPVR: 1A Adjustable LDO; PARTNO: LDFPUR
U4 = SLG46110V:SLG46110V: GPAK MIXED SIGNAL MATRIX Check prices <https://pricing.snapeda.com/parts/SLG46110V/Dialog%20Semiconductor%20GmbH/view-part?ref=eda>; AVAILABILITY: Not in stock; DESCRIPTION: GreenPAK Ultra-small programmable logic and mixed signal matrix, 1.8 V to 5 V supply, 8-GPIO, 2 ACMPs, 10 LUTs, 4 CNT/DLY, 4 DFF/LATCH and other Macrocells, STQFN12; MF: Dialog Semiconductor GmbH; MP: SLG46110V; PACKAGE: UFQFN-12 Dialog Semiconductor GmbH; PRICE: None
U5 = nxp:BGA2870: MMIC Wideband Amplifier; PARTNO: BGA2818,115
U6 = diodesinc:AZ23C3V6-7-F: Common Anode Zener Diode, 3.6V
U7 = nxp:AFT0SMS003N; PARTNO: AFT05MS003NT1
U8 = BGS12PL6:BGS12PL6: SPDT RF Switch, CMOS; PARTNO: ‎BGS12P2L6E6327XTSA1‎; VALUE: BGS12PL6
U9 = diodesinc:D3V3X8U9LP3810: 8 CHANNEL LOW CAPACITANCE TVS DIODE ARRAY; PARTNO: D3V3X8U9LP3810
U10 = johanson-technology:1575AT43A0040E: SMD Ceramic GNSS Antenna; PARTNO: 1575AT43A0040E
U11 U12 = EZRadioPRO:SI4463; PARTNO: SI4463-C2A-GMR
U13 = stm32:STM32L432KXXX; PARTNO: STM32L412K8U6
U14 U17 = diodesinc:DMN63D8LDW: Dual N-Channel MOSFET; PARTNO: DMN63D8LDW-7
X1 X2 = adafruit:XTAL-4: Classic 4-pin 3.2 x 2.5mm crystal; PARTNO: CX3225SB30000D0FPLCC
Z1 = MyPassives:RESISTOR: Standard SMD resistor; PARTNO: ‎GRM1885C1H120GA01D‎

## Board
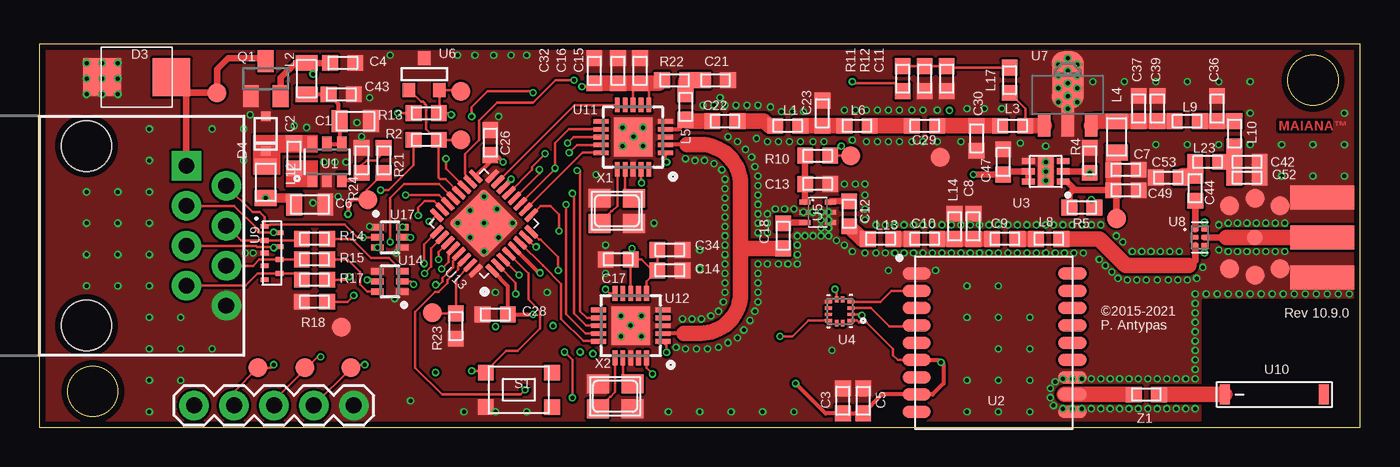
[diagram p7: board, top side]
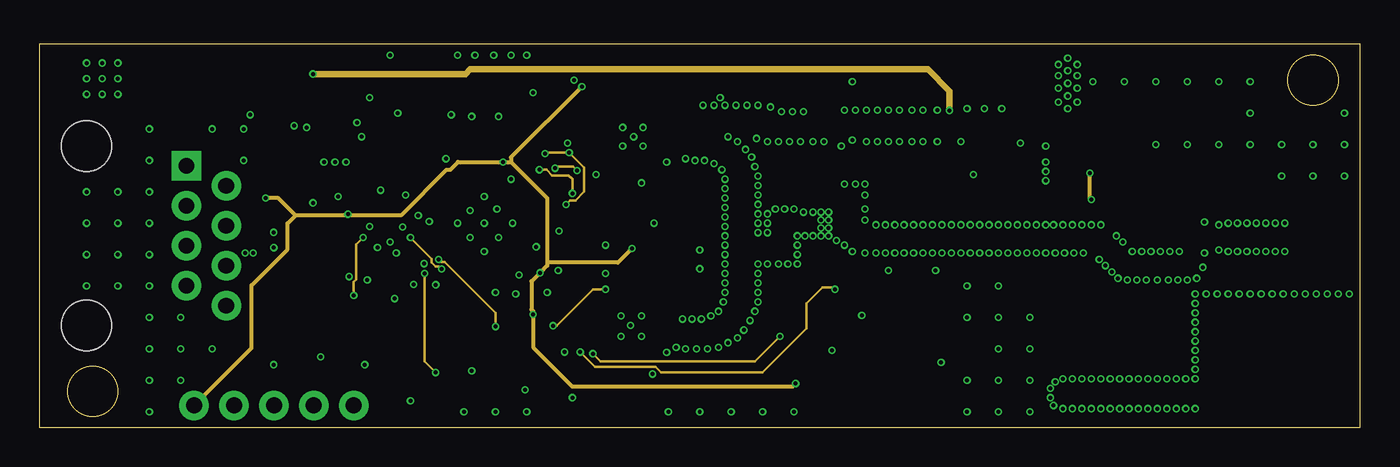
[diagram p8: board, inner layer Layer2]
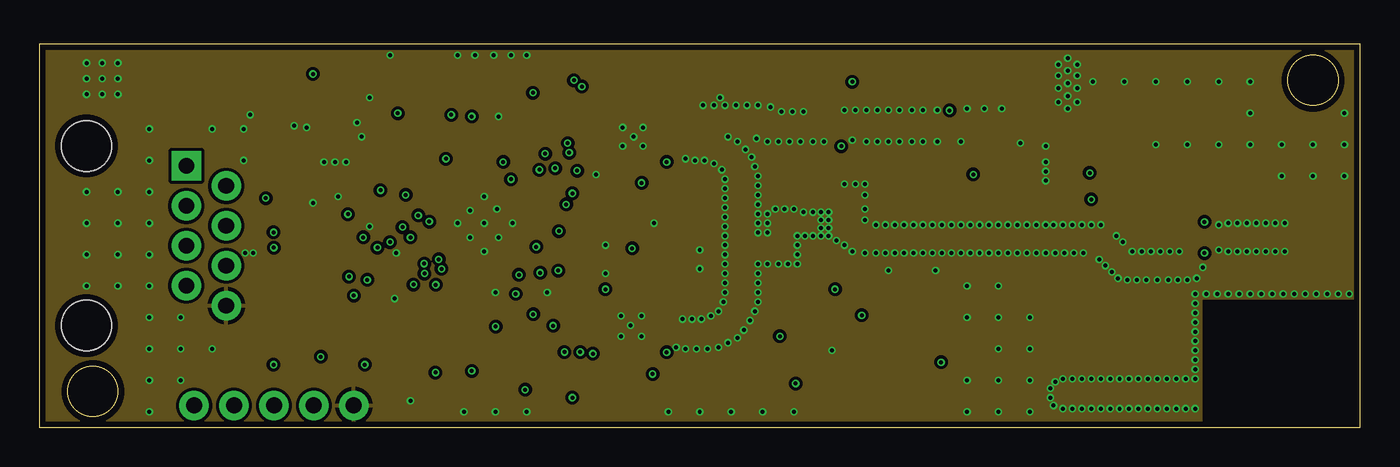
[diagram p9: board, inner layer Layer3]
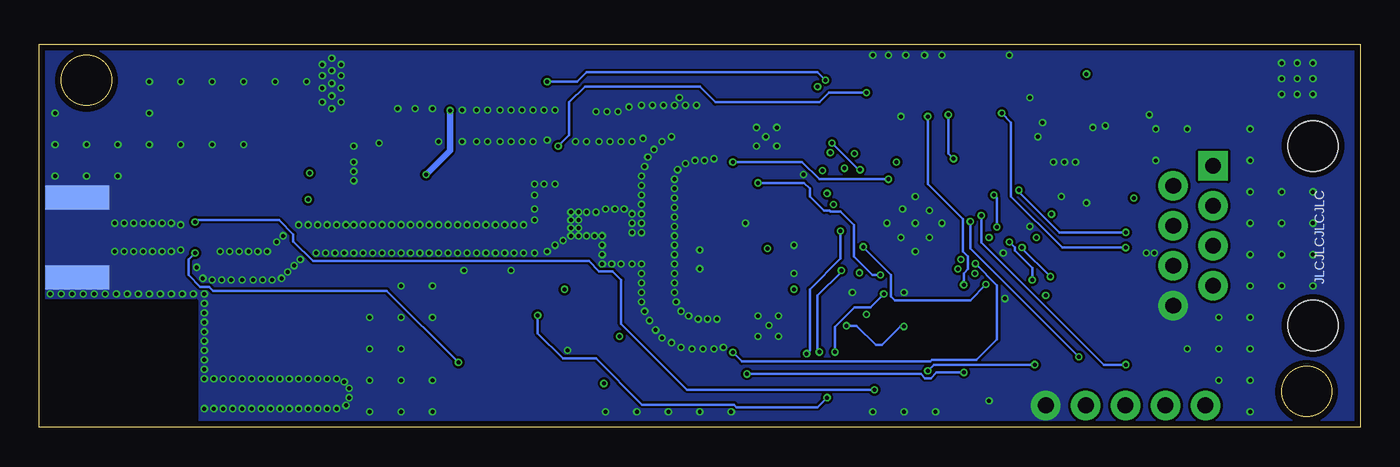
[diagram p10: board, bottom side, seen from below]

Size 84 x 24.4 mm. Coordinates in mm from the lower left corner, seen from the top.
Outline: 0,0 84,0 84,24.4 0,24.4 0,0
Outline: circle at 81,22.1 radius 1.6
Outline: circle at 3.4,2.3 radius 1.6
Copper layers (1+2*15+16): Top 0.035mm / dielectric 0.17mm / Layer2 0.018mm / dielectric 1.2mm / Layer3 0.018mm / dielectric 0.17mm / Bottom 0.035mm
Design rules "default *": minimum track width 5mil, minimum drill 10mil, track to track 6mil, track to pad 6mil, pad to pad 6mil, via to via 6mil, smd to smd 0mil, copper to edge 15mil, drill to drill 6mil, minimum pad ring 4mil, minimum via ring 4mil, stop-mask expansion 0mil, vias tented up to drill 20mil, thermal gap 10mil
tRestrict: area 74,0 to 84,8.1
bRestrict: area 74,0 to 84,8.1

### Footprints (pad centres in the part's own frame; a part is rotated, then mirrored left to right if it is on the bottom)
TP12R = smd 1.2 x 1.2: TP 0,0
0805 = smd 1 x 1.4: P$1 -1,0; P$2 1,0
0603 = smd 1 x 1: P$1 -0.8,0; P$2 0.8,0
SMB-BIDIR = smd 2.4 x 2.4: A 2.2,0; C -2.2,0
SOD323 = smd 0.6 x 0.6: A 1.1,0; C -1.1,0
SMA-EDGE = smd 1.524 x 4.064: GND@0 0,0; GND@1 5.08,0; SIG 2.54,0 | smd 1.524 x 4.064 bottom: GND@2 0,0; GND@3 5.08,0
1X05 = drill 1.016 pad 1.88: 1 0,0; 2 2.54,0; 3 5.08,0; 4 7.62,0; 5 10.16,0
RJ45-8 = drill 1 pad 1.88 square: 1 -4.445,6.35 | drill 1 pad 1.88: 2 -3.175,8.89; 3 -1.905,6.35; 4 -0.635,8.89; 5 0.635,6.35; 6 1.905,8.89; 7 3.175,6.35; 8 4.445,8.89 | hole 3.2: -5.715,0; 5.715,0
SOT23 = smd 1 x 1.4: 1 -0.95,-1.1; 2 0.95,-1.1; 3 0,1.1
TP10R = smd 1 x 1: TP 0,0
KMR221NGLFS = smd 1 x 1: P$1 -2.1,1.1; P$2 -2.1,-1.1; P$3 2.1,-1.1; P$4 2.1,1.1
SOT23-6 = smd 0.6 x 0.9: 1 -0.95,-1.15; 2 0,-1.15; 3 0.95,-1.15; 4 0.95,1.15; 5 0,1.15; 6 -0.95,1.15
GPS_MODULE = smd 1.8 x 0.8: P$1 -4.9,4.4; P$2 -4.9,3.3; P$3 -4.9,2.2; P$4 -4.9,1.1; P$5 -4.9,0; P$6 -4.9,-1.1; P$7 -4.9,-2.2; P$8 -4.9,-3.3; P$9 -4.9,-4.4; P$10 5,-4.4; P$11 5,-3.3; P$12 5,-2.2; P$13 5,-1.1; P$14 5,0; P$15 5,1.1; P$16 5,2.2; P$17 5,3.3; P$18 5,4.4
DFN6-2X2 = smd 0.8 x 0.4: P$1 -1.1,0.65; P$2 -1.1,0; P$3 -1.1,-0.65; P$4 1.1,-0.65; P$5 1.1,0; P$6 1.1,0.65 | smd 1 x 1.8: P$7 0,0
IC_SLG46110V = smd 0.465 x 0.21: 1 -0.718,0.6; 2 -0.718,0.2; 3 -0.718,-0.2; 4 -0.718,-0.6; 7 0.718,-0.6; 8 0.718,-0.2; 9 0.718,0.2; 10 0.718,0.6 | smd 0.21 x 0.39: 5 -0.2,-0.755; 6 0.2,-0.755; 11 0.2,0.755; 12 -0.2,0.755
SOT363 = smd 0.3 x 0.7: 1 -0.65,-0.8; 2 0,-0.8; 3 0.65,-0.8; 4 0.65,0.8; 5 0,0.8; 6 -0.65,0.8
SOT-23 = smd 0.787 x 0.889: 1 -0.991,-1.016; 2 0.94,-1.016; 3 -0.025,1.016
SOT-89 = smd 0.8 x 1.4: 1 -1.499,-1.981; 3 1.499,-1.981 | smd 0.8 x 1.9: 2 0,-1.727 | smd 2.032 x 3.65: 2@1 0,0.94
PSON50P145X100X50-6N = smd 0.42 x 0.31: 1 -0.29,0.5; 2 -0.29,0; 3 -0.29,-0.5; 4 0.29,-0.5; 5 0.29,0; 6 0.29,0.5
U-DFN3810-9(B) = smd 0.3 x 0.5: P$1 -1.7,-0.48; P$2 -0.8,-0.48; P$3 0,-0.48; P$4 0.8,-0.48; P$5 1.7,-0.48; P$6 1.3,0.48; P$7 0.4,0.48; P$8 -0.4,0.48; P$9 -1.3,0.48
1575AT43A0040E = smd 0.635 x 1.27: P$1 -3.2,0; P$2 3.1,0
SI4463 = smd 0.95 x 0.3: 1 -2.05,1; 2 -2.05,0.5; 3 -2.05,0; 4 -2.05,-0.5; 5 -2.05,-1; 11 2.05,-1; 12 2.05,-0.5; 13 2.05,0; 14 2.05,0.5; 15 2.05,1 | smd 0.3 x 0.95: 6 -1,-2.05; 7 -0.5,-2.05; 8 0,-2.05; 9 0.5,-2.05; 10 1,-2.05; 16 1,2.05; 17 0.5,2.05; 18 0,2.05; 19 -0.5,2.05; 20 -1,2.05 | smd 2.45 x 2.45: EXP 0,0
QFN32 = smd 1 x 0.3: 1 -2.5,1.75; 2 -2.5,1.25; 3 -2.5,0.75; 4 -2.5,0.25; 5 -2.5,-0.25; 6 -2.5,-0.75; 7 -2.5,-1.25; 8 -2.5,-1.75; 17 2.5,-1.75; 18 2.5,-1.25; 19 2.5,-0.75; 20 2.5,-0.25; 21 2.5,0.25; 22 2.5,0.75; 23 2.5,1.25; 24 2.5,1.75 | smd 0.3 x 1: 9 -1.75,-2.5; 10 -1.25,-2.5; 11 -0.75,-2.5; 12 -0.25,-2.5; 13 0.25,-2.5; 14 0.75,-2.5; 15 1.25,-2.5; 16 1.75,-2.5; 25 1.75,2.5; 26 1.25,2.5; 27 0.75,2.5; 28 0.25,2.5; 29 -0.25,2.5; 30 -0.75,2.5; 31 -1.25,2.5; 32 -1.75,2.5 | smd 3.2 x 3.2: EXP 0,0
SOT363' = smd 0.4 x 0.8: 1 -0.65,-0.8; 2 0,-0.8; 3 0.65,-0.8; 4 0.65,0.8; 5 0,0.8; 6 -0.65,0.8
NX3225 = smd 1.4 x 1.2: 1 -1.1,-0.8; 2 1.1,-0.8; 3 1.1,0.8; 4 -1.1,0.8

### Placement (x,y rotation side)
3V3  20.9,14.5 0 top
BOOT0  25,7.3 0 top
C1  20.1,19.5 0 top
C2  16.2,17.3 90 top
C3  51.1,1.7 90 top
C4  19.3,23.2 0 top
C5  52.4,1.7 90 top
C6  17.2,14.2 0 top
C7  69.1,16.4 0 top
C8  59.4,12.8 90 top
C9  61.4,12 180 top
C10  56.3,12 180 top
C11  57.7,22.2 270 top
C12  51.5,13.6 90 top
C13  49.5,15.5 0 top
C14  40.1,10 0 top
C15  38.2,22.7 90 top
C16  36.8,22.7 90 top
C17  36.82,10.7 180 top
C18  47.3,12.2 270 top
C21  43,22.1 0 top
C22  43.6,19.5 0 top
C23  49.8,20 90 top
C26  28.69,18.13 90 top
C28  28.99,7.19 180 top
C29  56.3,19.2 0 top
C30  59.6,18.4 270 top
C32  35.3,22.7 90 top
C34  40.1,11.3 0 top
C36  74.9,20.3 90 top
C37  69.9,20.3 90 top
C39  71.1,20.3 90 top
C42  76.8,16.9 0 top
C43  19.2,21.2 0 top
C44  73.51,15.23 270 top
C47  61.3,16.9 90 top
C49  69.1,15.1 0 top
C52  76.8,15.9 0 top
C53  71.8,15.9 180 top
D3  6.2,22.3 0 top
D4  14.4,18.7 90 top
GND1  57.3,17.2 0 top
GND2  19.2,6.4 0 top
J$1  81.6,9.55 90 top
JLINK  20,1.4 180 top  (not fitted)
JP1  3,12.2 270 top
L1  47.6,19.2 0 top
L2  17,22.2 270 top
L3  61.9,19.2 0 top
L4  68.51,18.49 90 top
L5  41.1,20.4 270 top
L6  52,19.2 0 top
L8  64.2,12 180 top
L9  73,19.5 0 top
L10  76,18.7 270 top
L12  14.4,15.6 270 top
L13  53.5,12 180 top
L14  58.2,12.8 270 top
L17  61.7,22.1 90 top
L23  74.3,16.9 180 top
NRST  19.8,3.8 0 top
Q1  14.4,22.2 0 top
R2  24.6,18.3 180 top
R4  66.8,17 270 top
R5  66.3,14 180 top
R10  49.5,17.3 180 top
R11  54.9,22.2 270 top
R12  56.3,22.2 90 top
R13  24.6,20 180 top
R14  17.5,12 180 top
R15  17.5,10.7 180 top
R17  17.5,9.4 180 top
R18  17.5,8 0 top
R21  21.9,17 270 top
R22  40.4,22.1 180 top
R23  26.49,6.46 270 top
R24  20.5,17 270 top
RF  77.3,12.1 0 top
RX  26.8,18.3 0 top
S1  30.5,2.4 0 top  (not fitted)
SWCLK  16.9,3.8 0 top
SWDIO  13.9,3.8 0 top
SWDIO1  78.9,14.1 0 top
SWDIO2  78.9,10.1 0 top
SWDIO3  75.7,14.1 0 top
SWDIO4  75.7,10.1 0 top
SWDIO5  77.3,14.6 0 top
SWDIO6  77.3,9.7 0 top
TX  26.8,21.4 0 top
U1  18.3,16.9 0 top
U2  60.7,5.4 0 top
U3  64,16.3 180 top
U4  50.9,7.4 180 top
U5  49.5,13.7 270 top
U6  24.5,22.5 0 top
U7  65.4,21.18 0 top
U8  73.8,12.1 0 top
U9  14.8,11.1 270 top
U10  78.59,2.1 0 top
U11  37.76,18.48 180 top
U12  37.61,6.48 180 top
U13  28.28,12.99 135 top
U14  DMN63D8LDW-7  [SOT363']  22.3,9.3 90 top
U17  DMN63D8LDW-7  [SOT363']  22.3,12.1 270 top
V_IN  11.3,21.3 0 top
V_LNA  51.6,17.3 0 top
V_PA  68.5,13.3 0 top
X1  36.73,13.79 0 top
X2  36.62,1.99 0 top
Z1  70.4,2.1 180 top

### Tracks (layer width: path | path; a pad name or v marks a point on that pad's centre or on a via)
3.3V  (via drill 0.25)
  Top 0.152: U11.8 37.76,21.84 37.7,21.9 | U11.6 38.76,21.86 38.8,21.9 | U12.6 38.61,9.31 39.15,9.85 | 39.15,9.85 C14.P$1 C34.P$1 | 39.15,9.85 38.3,10.7 C17.P$1 U12.8 | R21.P$2 20.8,15.1 20.8,14.5 | v74.1,11.1 v74.09,11.11 U8.4 | U4.1 52,6.8 52.11,6.69 52.61,6.69 54.3,5 54.3,4.6 54.6,4.3 U2.P$6
  Top 0.254: U2.P$6 57.2,4.3 v57.35,4.15 57.5,4 57.5,2.8 56.8,2.1 U2.P$8 53.6,2.1 C5.P$1 C3.P$1 50,0.9 v48.1,2.8 | v29.5,16.9 29.07,17.33 C26.P$1 28.69,16.94 U13.17 | U13.5 31.77,9.85 v31.85,9.85 | U13.1 29.79,9.01 C28.P$1 v31.4,7.2 | C32.P$1 35.1,21.7 v34.5,21.7 | C17.P$1 37.62,11.32 v37.7,11.4 | 3V3.TP 20.8,14.5 19.9,14.5 19.63,14.23 v19.63,13.57
  Top 0.61: C6.P$1 15.8,14.6 L12.P$2
  Top 1: R22.P$2 39.4,21.9 38.8,21.9 C15.P$1 37.7,21.9 C16.P$1 C32.P$1
  Layer2 0.254: 30,16.9 v29.5,16.9 26.63,16.9 26.14,16.41 25.91,16.41 23,13.5 19.7,13.5 | 30,16.9 32.3,14.6 32.3,10.5 | 32.3,10.5 32.3,10.3 v31.85,9.85 31.3,9.3 31.3,7.5 31.4,7.4 v31.4,7.2 31.4,5.1 33.9,2.6 47.9,2.6 v48.1,2.8 | v34.5,21.7 30,17.2 30,16.9 | JLINK.5 13.5,5.06 13.5,9.04 15.79,11.33 15.79,12.99 16.3,13.5 | v37.7,11.4 36.8,10.5 32.3,10.5 | 19.7,13.5 16.3,13.5 | L12.P$2 15.2,14.6 16.3,13.5 | v19.63,13.57 19.7,13.5
  Bottom 0.152: v57.35,4.15 61.9,8.7 72.95,8.7 73.21,8.96 73.76,8.96 74.5,9.7 74.5,10.7 v74.1,11.1
  other vias: 14.4,14.6
BOOT0
  Top 0.152: U13.31 26.49,9.43 R23.P$1 25.04,7.26 BOOT0.TP
CS1
  Top 0.152: U13.10 34.54,17.48 U11.15
CS2
  Top 0.152: U12.15 35.54,5.5 34.6,5.5 33.2,6.91 33.2,9.15 32.04,10.31 32.02,10.31 U13.6
GND  (via drill 0.25)
  other vias: 13.6,11.1 13.1,11.1 22.6,8.2 23.6,1.7 22.7,11.1 21,12.8 29.2,19.8 50.4,4.9 83.3,8.5 82.6,8.5 81.9,8.5 81.2,8.5 80.5,8.5 79.8,8.5 79.1,8.5 78.4,8.5 77.7,8.5 77,8.5 76.3,8.5 75.6,8.5 74.9,8.5 74.2,8.5 73.5,8.5 73.5,7.9 73.5,7.3 73.5,6.7 73.5,6.1 73.5,5.5 73.5,4.9 73.5,4.3 73.5,3.7 73.5,3.1 73.5,1.2 72.9,1.2 72.3,1.2 71.7,1.2 71.1,1.2 70.5,1.2 69.9,1.2 69.3,1.2 68.7,1.2 68.1,1.2 67.5,1.2 66.9,1.2 72.9,3.1 72.3,3.1 71.7,3.1 71.1,3.1 70.5,3.1 69.9,3.1 69.3,3.1 68.7,3.1 68.1,3.1 67.5,3.1 66.9,3.1 79.2,11.2 78.6,11.2 78,11.2 77.4,11.2 76.8,11.2 76.2,11.2 75.6,11.2 75,11.3 75.6,13 75,12.9 76.2,13 76.8,13 77.4,13 78,13 78.6,13 79.2,13 74,10.2 73.6,9.5 73,9.4 72.4,9.4 70.7,11.2 70.1,11.2 69.5,11.2 68.9,11.8 68.5,12.2 68.2,9.9 67.8,10.3 67.4,10.7 66.4,11.1 65.8,11.1 65.2,11.1 64.6,11.1 66.3,12.9 64.5,12.9 71.8,9.4 68.6,9.5 69.2,9.4 69.8,9.4 70.4,9.4 66.9,12.9 67.5,12.9 65.7,12.9 65.1,12.9 64,11.1 63.4,11.1 62.8,11.1 62.2,11.1 61.6,11.1 61,11.1 60.4,11.1 59.8,11.1 59.2,11.1 58.6,11.1 58,11.1 57.4,11.1 56.8,11.1 56.2,11.1 55.6,11.1 55,11.1 54.4,11.1 53.8,11.1 53.2,11.1 51.7,11.2 51.2,11.6 50.7,11.9 50.2,13.7 49.7,13.7 49.7,13.2 50.2,13.2 49.7,12.7 50.2,12.7 49.2,13.7 48.6,13.7 53.2,12.9 53.8,12.9 54.4,12.9 55,12.9 55.6,12.9 56.2,12.9 56.8,12.9 57.4,12.9 58,12.9 58.6,12.9 59.2,12.9 59.8,12.9 60.4,12.9 61,12.9 61.6,12.9 62.2,12.9 62.8,12.9 63.4,12.9 64,12.9 64.6,2.9 64.3,2.5 64.3,1.9 66.3,3.1 65.7,3.1 65.1,3.1 66.3,1.2 65.7,1.2 65.1,1.2 64.5,1.4 48,13.9 47.4,13.9 46.8,13.9 46.3,12.4 45.7,12.4 45.7,13 45.7,13.6 45.7,14.2 45.7,14.8 45.7,15.4 45.7,16 45.5,16.6 45.3,17.2 44.9,17.7 44.4,18.2 43.8,18.5 45.7,10.4 45.7,9.8 45.5,7.4 45.2,6.8 44.8,6.2 44.4,5.7 43.8,5.4 43.2,5.1 42.5,5 41.8,5 41.1,5 40.5,5.1 43.6,10.4 43.6,9.8 43.2,7.4 42.7,7.1 42.1,6.9 41.5,6.9 40.9,6.9 43.6,11 43.6,11.6 43.6,12.2 43.6,12.8 43.6,13.4 43.6,14 43.6,14.6 43.6,15.2 43.6,15.8 43.4,16.4 42.9,16.8 42.3,17 41.7,17 41.1,17.1 46.3,10.4 47,10.4 47.6,10.4 48.2,10.4 48.2,11 48.2,11.6 48.2,12.2 49.7,12.2 49.2,12.2 50.2,12.2 48.7,12.2 51.2,15.5 51.9,15.5 52.5,14.8 83,16 83,18 83,20 81,18 81,16 79,16 79,18 77,18 77,20 77,22 75,22 73,22 71,22 69,22 67,22 71,18 73,18 75,18 63,1 61,1 59,1 59,3 61,3 63,3 63,5 61,5 63,7 61,7 59,7 59,9 61,9 57,10 54,10 46,1 44,1 42,1 40,1 48,1 7,1 7,3 7,5 7,7 7,9 7,11 7,13 7,15 7,17 7,19 5,15 5,13 5,11 5,9 3,11 3,13 3,15 3,9 9,5 4,22.2 4,21.2 3,21.2 3,22.2 3,23.2 4,23.2 5,23.2 5,22.2 5,21.2 11,5 9,3 9,7 11,19 13,19 13,17 21,21 43.6,9.2 45.7,9.2 54.7,20.2 56.2,20.2 57.1,20.2 60.1,20.3 61.2,20.3 64.8,23.1 66,23.1 64.8,22.4 66,22.4 65.4,22.7 65.4,21.9 64.8,21.6 66,21.6 65.4,21.1 64.8,20.7 66,20.7 65.4,20.3 65.4,23.5 64,15.7 64,16.9 54,18.2 53.3,18.2 26.6,13 27.4,13.8 28.3,14.7 29.1,13.9 30.1,13 27.4,12.1 28.3,11.2 29.2,12.1 28.3,13 37.1,19.1 37.1,17.9 38.4,17.9 38.4,19.1 37.8,18.5 37,7.1 38.3,7.1 38.3,5.8 37,5.8 37.6,6.5 43.3,21 31,23.7 30,23.7 28.9,23.7 27.7,23.7 26.6,23.7 22.3,23.7 29,8.6 32.3,8.6 31,1 29,1 27,1 45.7,8.6 43.6,8.6 43.5,8 45.7,8 42,11.3 42,10.1 39.1,13 35.4,16.1 36,11.6 36,9.8 46.3,13 46.3,13.6 59,20.3 64,16.3 18.1,16.9 18.8,16.9 19.5,16.9 13.4,19.9 16.2,19.2 17,19.1 20.2,19.4 20.5,18.5 19,14.7 17.4,14.3 56.2,18.2 57.1,18.2 62.4,18.1 64,17.9 52.5,11.1 52.5,13.9 52.5,13.2 52.5,15.5 71.3,11.2 71.9,11.2 72.5,11.2 71.1,9.4 42.2,20.5 42.9,20.5 43.6,20.5 44.3,20.5 45,20.5 45.7,20.5 46.5,20.4 47.2,20.1 47.9,20.1 48.6,20.1 54,20.2 53.3,20.2 52.6,20.2 51.9,20.2 51.2,20.2 54.7,18.2 55.5,18.2 55.5,20.2 52.6,18.2 45.6,18.4 46.3,18.2 47,18.2 47.7,18.2 48.4,18.2 49.2,18.2 49.9,18.2 51.7,18.3 58.6,18.2
  pour Top (isolate 0.1, no thermals): -0.9,25.2 86.3,25.2 86.3,-1.7 -0.9,-1.7
  pour Bottom (isolate 0.1, no thermals): -3,28 87,28 87,-3 -3,-3
  pour Layer3 (isolate 0.2): -1.6,27 85.3,27 85.3,8.2 73.9,8.2 73.9,-2.4 -1.6,-2.4
GPS_1PPS
  Top 0.152: U4.3 52.9,7.6 54.05,6.45 55.75,6.45 U2.P$4
GPS_EN  (via drill 0.25)
  Top 0.152: U13.2 30.3,9.2 v30.3,8.5 | v33.4,4.8 33.9,4.3 v33.9,1.9 | U4.2 52.24,7.2 v52.3,7.14
  Bottom 0.152: v33.4,4.8 33.4,6.41 32.15,7.66 31.14,7.66 v30.3,8.5 | v33.9,1.9 34.5,1.3 39.65,1.3 39.81,1.46 45.66,1.46 48.6,4.4 50.7,4.4 52.3,6 v52.3,7.14
GPS_STATUS  (via drill 0.25)
  Top 0.152: U13.21 25.42,15.49 25.37,15.49 25.37,15.5 23.2,15.5 22.3,14.6 v22.3,11.8 | v20.86,9.4 21.4,9.4 U14.5
  Bottom 0.152: v22.3,11.8 21.96,11.46 21.96,11.26 20.86,10.16 v20.86,9.4
GPS_UART_TX
  Top 0.152: U2.P$2 54.2,8.7 53.5,8 U4.4
HOST_GPS_STATUS
  Top 0.152: JP1.4 12.82,11.9 U9.P$2 16.6,11.9 R14.P$2
HOST_RX_STATUS
  Top 0.152: R15.P$2 16.65,10.65 16.6,10.7 U9.P$7 15.26,10.68 13.97,10.68 13.59,10.29 JP1.6
HOST_TX_OFF  (via drill 0.25)
  Top 0.152: JP1.2 13.56,13.7 14,13.7 14.32,13.38 U9.P$1 14.68,12.9 14.69,12.91 19.42,12.91 20.23,12.1 v20.6,12.1 U17.2 | R18.P$2 19.6,8 v20,8.4
  Layer2 0.152: v20,8.4 20,9.25 20.16,9.41 20.16,11.66 v20.6,12.1
HOST_TX_STATUS
  Top 0.152: JP1.7 13.12,9.03 13.9,9.8 U9.P$6 16.3,9.8 R17.P$2
HOST_UART_RX  (via drill 0.25)
  Top 0.152: v22.8,20 R13.P$2 | U9.P$8 14.9,11.5 | 14.9,11.5 13.85,11.5 13.79,11.56 JP1.5 | v14.92,11.44 14.9,11.46 14.9,11.5
  Bottom 0.152: v22.8,20 22.2,19.4 22.2,14.7 18.94,11.44 v14.92,11.44
HOST_UART_TX  (via drill 0.25)
  Top 0.152: JP1.3 12.39,14.11 13.84,12.65 13.84,12.55 13.97,12.42 v14.9,12.42 15.26,12.42 U9.P$9 | v21.7,15.1 22.2,15.1 23.8,16.7 R2.P$2
  Bottom 0.152: v21.7,15.1 21.7,15 19.12,12.42 v14.9,12.42
LNA_PWR  (via drill 0.25)
  Top 0.152: R10.P$1 V_LNA.TP v51,17.9 | U13.29 26.69,10.97 26.32,10.61 26.32,10.19 25.66,9.53 25.66,9.31 25.32,8.98 v25.22,9.08 | v27.5,19.8 27.5,20.4 28.5,21.4 31.3,21.4 v31.39,21.31
  Bottom 0.152: v27.5,19.8 27.5,15.5 25.26,13.26 25.26,11.2 24.94,10.89 24.94,10.08 25.22,9.8 v25.22,9.08 | v51,17.9 50.3,18.6 50.3,20.7 49.3,21.7 42,21.7 41,20.7 34.4,20.7 33.79,21.31 v31.39,21.31
MCU_GPS_1PPS  (via drill 0.25)
  Top 0.152: U13.8 31.79,11.96 31.89,11.96 33,10.85 v33,9.99 | U4.6 50.7,8.7 v50.6,8.8
  Layer2 0.152: v34.4,4.8 35.34,3.86 39.19,3.86 39.55,3.5 46,3.5 48.8,6.3 48.8,7.9 49.8,8.9 50.5,8.9 v50.6,8.8
  Bottom 0.152: v33,9.99 33,9.89 34.5,8.39 34.5,4.9 v34.4,4.8
MCU_GPS_UART_RX  (via drill 0.25)
  Top 0.152: U13.9 31.86,14.1 32.5,14.1 33.04,13.56 v33.04,12.5 | v47.1,5.8 47.9,5.8 48.9,6.8 U4.10
  Layer2 0.152: v35.2,4.7 35.7,4.2 45.5,4.2 v47.1,5.8
  Bottom 0.152: v33.04,12.5 33.04,10.76 35,8.8 35,4.9 v35.2,4.7
MCU_TX_OFF  (via drill 0.25)
  Top 0.152: U13.22 25.41,14.8 v23.3,14.8
  Bottom 0.152: v23.3,14.8 23.1,14.6 U17.6
  other vias: 23.1,12.75
MCU_UART_RX
  Top 0.152: R2.P$1 RX.TP | U13.20 25.82,15.8 25.5,15.8 25.4,15.9 R2.P$1 | U6.1 24.27,20.73 24.39,20.73 24.6,20.52 24.6,19 25.3,18.3 R2.P$1
MCU_UART_TX  (via drill 0.25)
  Top 0.152: U13.19 25.86,16.47 v25.86,17.1 | TX.TP 26.72,21.48 U6.2 25.44,20.04 R13.P$1 26.1,20 v26.2,19.9
  Bottom 0.152: v26.2,19.9 26.2,17.44 v25.86,17.1
MISO  (via drill 0.25)
  Top 0.152: U11.13 33.98,18.48 v33.6,18.1 | v31.8,16.4 31.8,16.16 U13.12 | U12.13 35.54,6.5 34.77,6.5 34,7.27 34,14.8 v33.9,14.9
  Layer2 0.152: v33.9,14.9 33.9,15.8 33.66,16.04 32.61,16.04 32.25,16.4 v31.8,16.4
  Bottom 0.152: v33.6,18.1 31.9,16.4 v31.8,16.4
MOSI  (via drill 0.25)
  Top 0.152: U11.14 34.19,17.98 v33.7,17.49 | v32.17,17.43 32.17,17.42 31.34,16.59 31.34,16.41 U13.13 | U12.14 35.54,6 34.74,6 33.5,7.24 33.5,14.15 33.5,14.16 v33.5,14.2
  Layer2 0.152: v32.17,17.43 32.24,17.5 v33.69,17.5 v33.7,17.49 34.66,16.53 34.66,15.01 34.09,14.44 33.75,14.44 v33.5,14.2
N$1
  Top 0.406: U5.6 50.35,14.4 C12.P$2
N$2
  Top 1: L8.P$2 C9.P$1
N$3
  Top 1: C9.P$2 C8.P$1 L14.P$2 C10.P$1
N$4
  Top 1: C10.P$2 L13.P$1
N$5
  Top 1: L13.P$2 52.3,12 C12.P$1
N$6
  Top 0.406: U5.1 C13.P$1 R10.P$2
N$8
  Top 0.254: C2.P$2 16.25,18.05 | 16.25,18.05 U1.6 | 16.25,18.05 15.15,18.05 D4.C L12.P$1
N$9
  Top 0.406: U5.3 47.35,13.05 C18.P$1
N$12
  Top 1: L6.P$1 C23.P$1 L1.P$2
N$13
  Top 0.152: R14.P$1 19.9,12 21.1,10.8 22.25,10.8 U14.3
N$14
  Top 0.152: R15.P$1 19.6,10.7 20.4,9.9 20.4,9.1 20.85,8.65 U14.6
N$15
  Top 0.406: U8.5 75.5,12.1
  Top 1: J$1.SIG RF.TP 75.5,12.1
N$16
  Top 0.152: X2.1 36.29,1.96 36.31,1.96 36.61,2.26 U12.16
N$17
  Top 0.152: U12.17 37.11,3.4 X2.3
N$18
  Top 0.152: X1.1 36.4,13.76 36.42,13.76 36.76,14.1 U11.16
N$19
  Top 0.152: U11.17 37.26,15.16 X1.3
N$20  (via drill 0.25)
  Top 0.152: R17.P$1 19.5,9.4 v19.7,9.6
  Bottom 0.152: v19.7,9.6 21.5,11.4 U17.3
  other vias: 21.5,11.45
N$21
  Top 0.254: C2.P$1 16.95,15.75 U1.1
N$22
  Top 0.152: R24.P$2 20.5,16.7 20.8,17 21.4,17 21.9,17.5 21.9,17.6
  Top 0.254: U1.3 20.05,15.75 R24.P$2 | 21.9,17.6 R21.P$1
N$23
  Top 1: L9.P$1 C39.P$1 C37.P$1 L4.P$2 67.19,19.49 U7.3
N$24
  Top 0.254: U11.4 40.68,18.98 41.2,19.5
  Top 1: C22.P$1 41.2,19.5 L5.P$2
N$26
  Top 0.152: L17.P$1 62.7,20.3 L3.P$2
  Top 1: L3.P$2 U7.1
N$27
  Top 0.254: L2.P$2 C43.P$1 19,20.6 19,19.6 C1.P$1 19.1,18.05 | U1.5 19.1,18.05 | 19.1,18.05 U1.4
N$28
  Top 1: L10.P$1 C36.P$1 L9.P$2
N$29
  Top 1: L3.P$1 C30.P$1 C29.P$2
N$30
  Top 1: L5.P$1 41.1,22 R22.P$1 C21.P$1
N$31
  Top 1: L1.P$1 46.4,19.2 46.1,19.5 C22.P$2
N$32  (via drill 0.25)
  Top 0.406: R5.P$1 66.9,14.2 v66.9,14.52 | U3.P$2 66.7,16.3 R4.P$2
  Layer2 0.254: v66.9,14.52 66.8,14.62 R4.P$2
  other vias: 66.8,16.2
N$33
  Top 1: U10.P$1 Z1.P$1
N$34
  Top 1: 65.2,2.1 U2.P$11 Z1.P$2
N$40
  Top 1: L23.P$1 C42.P$1 | L10.P$2 C42.P$1 | C52.P$1 C42.P$1
N$41
  Top 1: C53.P$1 72.73,16.03 C44.P$1 L23.P$2
NRST  (via drill 0.25)
  Top 0.152: U13.4 31.1,9.82 31.1,8.15 31.86,7.39 31.86,6.31 30.42,4.87 29.67,4.87 28.35,3.55 | JLINK.2 19.8,3.74 NRST.TP 20,4 v20.7,4 | v27.5,3.6 28.3,3.6 28.35,3.55 | 28.35,3.55 S1.P$1
  Bottom 0.152: v20.7,4 27.1,4 v27.5,3.6
PA_GATE_BIAS
  Top 0.152: R11.P$1 R12.P$2 C11.P$1 57.8,22.9 L17.P$2
PA_IN
  Top 1: L6.P$2 C29.P$1
PA_OUT
  Top 0.406: C44.P$2 73.51,14.41 U8.1
RF_IN
  Top 0.406: 73.1,10.3 73.2,10.3 73.51,10.61 U8.3
  Top 1: 73.1,10.3 69.1,10.3 67.4,12 L8.P$1
RFSW_CTRL  (via drill 0.25)
  Top 0.152: U13.30 26.63,10.28 26.63,10.07 25.96,9.4 25.96,9.18 25.41,8.63 25.16,8.63 23.9,7.37 23.9,3.8 25.6,2.1 30.6,2.1 v30.9,2.4 | U8.6 v74.09,13.07 v74.1,13.08
  Bottom 0.152: v30.9,2.4 42.8,2.4 47,6.6 47,9.4 47.54,9.94 48.39,9.94 49.05,10.6 66.6,10.6 67.84,11.84 67.84,12.29 68.75,13.2 73.98,13.2 v74.1,13.08
RX_IC_CLK  (via drill 0.25)
  Top 0.152: v24.5,9.8 v24.5,9.81 24.93,10.24 24.93,11.41 U13.26 | v39,3.4 38.61,3.79 U12.20
  Layer2 0.152: v24.5,9.8 24.5,4.2 v25.2,3.5
  Bottom 0.152: v25.2,3.5 26.95,3.5 27.31,3.14 27.69,3.14 27.95,3.4 v39,3.4
RX_IC_DATA  (via drill 0.25)
  Top 0.152: U13.27 25.4,11.17 v25.4,10.7 | U12.10 36.27,8.53 v36,8.8
  Layer2 0.152: v25.4,10.7 25.55,10.55 25.76,10.55 29.02,7.29 v29.02,6.42 | v32.68,6.48 32.88,6.48 35.2,8.8 v36,8.8
  Bottom 0.152: v29.02,6.42 29.23,6.42 30.41,5.24 30.79,5.24 32.03,6.48 v32.68,6.48
RX_IN
  Top 0.254: 41,6 39.68,6 arc90 U12.2 | 41.2,18 39.83,18 arc90 U11.2
  Top 1: 41,6 42.06,6 arc90 44.6,8.54 44.6,11.5 | 44.6,11.5 44.6,15.46 arc90 42.06,18 41.2,18 | C18.P$2 44.7,11.4 44.6,11.5
RX_STATUS  (via drill 0.25)
  Top 0.152: U13.7 31.54,11.5 v31.6,11.5 | U14.2 23.6,9.3 v23.8,9.1
  Bottom 0.152: v23.8,9.1 24.8,8.1 29.6,8.1 29.84,8.34 29.84,9.7 31.6,11.46 v31.6,11.5
SCK  (via drill 0.25)
  Top 0.152: U11.12 33.68,18.98 32.8,18.1 v32.8,16.5 32.8,16.45 U13.11 | U12.12 34.82,6.98 34.4,7.4 34.4,16.34 v34.2,16.34
  Layer2 0.152: v34.2,16.34 33.94,16.6 32.9,16.6 v32.8,16.5
SDN1  (via drill 0.25)
  Top 0.152: U13.14 30,15.77 v30,15.8 | v39.9,16.9 39.81,16.99 U11.1
  Bottom 0.152: v30,15.8 34.4,15.8 35.5,16.9 v39.9,16.9
SDN2  (via drill 0.25)
  Top 0.152: U13.25 24.47,11.66 v24.47,10.43 | U12.1 39.9,5.24 v39.9,4.79
  Bottom 0.152: v24.47,10.43 23.1,9.05 23.1,5.6 24.39,4.3 27.23,4.3 27.33,4.2 39.31,4.2 v39.9,4.79
SWCLK  (via drill 0.25)
  Top 0.152: U13.24 24.85,13.1 v24.8,13.1 | v17.9,4.5 17.7,4.5 17,3.8 | 17,3.8 14.92,1.72 JLINK.3 | SWCLK.TP 17,3.8
  Bottom 0.152: v24.8,13.1 24.8,11.4 v17.9,4.5
SWDIO  (via drill 0.25)
  Top 0.152: U13.23 25.1,14.4 24.5,14.4 24.1,14 v24.1,13.5 | v14.9,4 14.7,3.8 SWDIO.TP 12.38,2.28 JLINK.4
  Bottom 0.152: v14.9,4 16.32,4 24.1,11.78 v24.1,13.5
TRX_IC_CLOCK  (via drill 0.25)
  Top 0.152: U13.3 v30.5,9.71 | v38.3,15.57 38.26,15.61 U11.19
  Bottom 0.152: v30.5,9.71 31.01,9.71 32.2,10.9 32.2,12.9 33.04,13.74 33.69,13.74 33.75,13.8 34.1,13.8 35,14.7 35,15.2 35.37,15.57 v38.3,15.57
TRX_IC_DATA
  Top 0.152: U13.15 34.05,20.53 U11.10
TX_STATUS  (via drill 0.25)
  Top 0.152: U13.28 26.34,11.33 26.02,11.01 26.02,10.54 v25.57,10.09 | U17.5 v23.6,12.1
  Layer2 0.152: v23.6,12.1 23.6,12.06 24.94,10.72 24.94,10.51 25.21,10.24 25.42,10.24 v25.57,10.09
V_IN
  Top 0.406: Q1.3 14.2,23.5 12,23.5 11.3,22.8 V_IN.TP 9.55,21.3 9.35,21.5 | JP1.1 9.35,21.5 | D3.A 8.55,22.3 9.35,21.5
V_PA
  Top 0.406: 65.9,15.1 65.75,15.1 65.5,14.85 R5.P$2 | 65.9,15.1 C49.P$1 68.5,14.9 V_PA.TP | U3.P$1 65.35,15.65 65.9,15.1
  Top 1: L4.P$1 68.3,17.28 C7.P$1 C49.P$1
V_PA_BIAS  (via drill 0.25)
  Top 0.152: U13.18 27.4,15.81 27.08,16.13 27.08,17.41 27.96,18.29 27.96,19.52 29.11,20.67 31.4,20.67 32.83,22.1 v34,22.1 | v51.7,22 51.8,21.9 54.4,21.9 R11.P$2
  Bottom 0.152: v51.7,22 49.8,22 49.2,22.6 34.5,22.6 v34,22.1
V_PROT  (via drill 0.25)
  Top 0.406: L2.P$1 16.3,23.2 15.35,22.25 Q1.2 | L2.P$1 16.9,23.2 17.4,22.7 v17.4,22.5 | L2.P$1 C4.P$1 | v59.4,16.1 C47.P$1 61.5,16.3 U3.P$5 U3.P$6
  Layer2 0.406: v17.4,22.5 27.1,22.5 27.4,22.8 56.5,22.8 57.88,21.42 v57.88,20.18
  Bottom 0.406: v57.88,20.18 57.88,17.62 v59.4,16.1
(copper drawn outside any net)
  shapes: Top area x4

### Text on the board
Top: MAIANA™
tNames: Rev 10.9.0 | ©2015-2021 / P. Antypas
bNames: JLCJLCJLCJLC